# Altium project roach2_project.PrjPCB (part 6 of 13)

## Sheet qdr0_1.SchDoc: Virtex-6 QDRs 0 & 1
size A3; Date: DO NOT USE, RATHER USE PROJ OPTIONS; DrawnBy: DO NOT USE, RATHER USE PROJ OPTIONS; Engineer: DO NOT USE, RATHER USE PROJ OPTIONS; Organization: DO NOT USE, RATHER USE PROJ OPTIONS; DocumentNumber: DO NOT USE, RATHER USE PROJ OPTIONS; Revision: DO NOT USE, RATHER USE PROJ OPTIONS; SheetNumber: 19; SheetTotal: 27; SCH_Sheet_Filename: qdr0_1.SchDoc; CurrentTime: DO NOT USE, RATHER USE PROJ OPTIONS; Time: DO NOT USE, RATHER USE PROJ OPTIONS; DocumentFullPathAndName: DO NOT USE, RATHER USE PROJ OPTIONS; DocumentName: DO NOT USE, RATHER USE PROJ OPTIONS; ModifiedDate: DO NOT USE, RATHER USE PROJ OPTIONS; ImagePath: DO NOT USE, RATHER USE PROJ OPTIONS
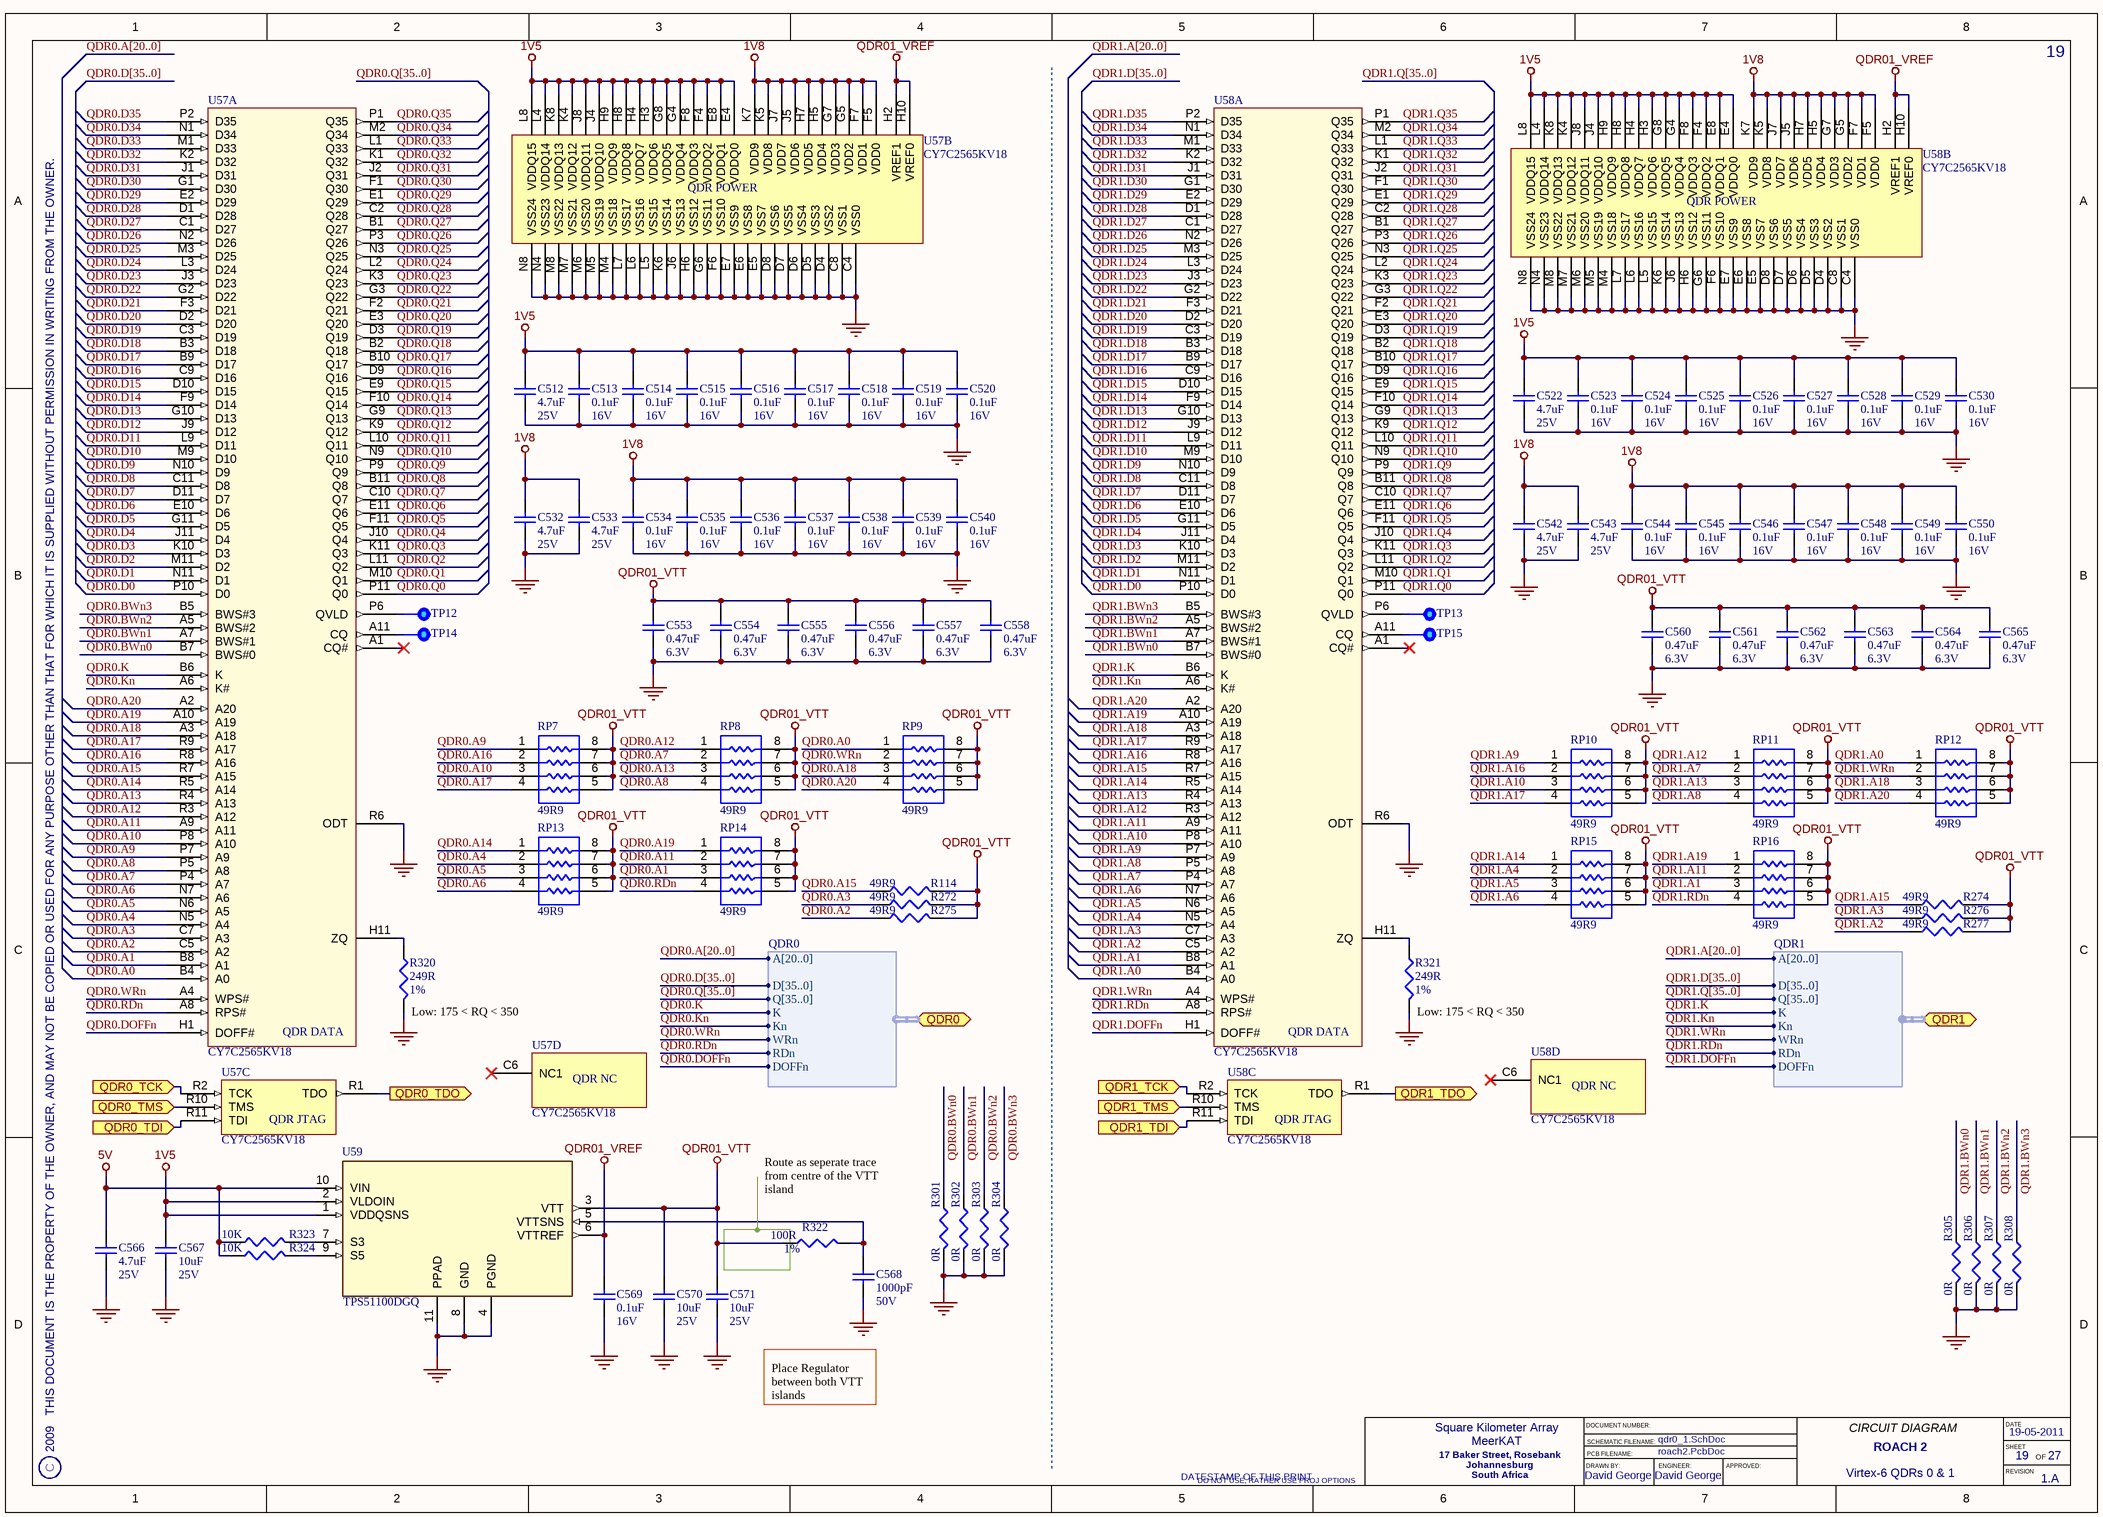
[diagram p11: qdr0_1.SchDoc]

### Parts
C512  Rating: 25V  [CAPC2012X127L]  (hidden comment: 4.7uF)
C513  Rating: 16V  [CAPC1005X60L]  (hidden comment: 0.1uF)
C514  Rating: 16V  [CAPC1005X60L]  (hidden comment: 0.1uF)
C515  Rating: 16V  [CAPC1005X60L]  (hidden comment: 0.1uF)
C516  Rating: 16V  [CAPC1005X60L]  (hidden comment: 0.1uF)
C517  Rating: 16V  [CAPC1005X60L]  (hidden comment: 0.1uF)
C518  Rating: 16V  [CAPC1005X60L]  (hidden comment: 0.1uF)
C519  Rating: 16V  [CAPC1005X60L]  (hidden comment: 0.1uF)
C520  Rating: 16V  [CAPC1005X60L]  (hidden comment: 0.1uF)
C522  Rating: 25V  [CAPC2012X127L]  (hidden comment: 4.7uF)
C523  Rating: 16V  [CAPC1005X60L]  (hidden comment: 0.1uF)
C524  Rating: 16V  [CAPC1005X60L]  (hidden comment: 0.1uF)
C525  Rating: 16V  [CAPC1005X60L]  (hidden comment: 0.1uF)
C526  Rating: 16V  [CAPC1005X60L]  (hidden comment: 0.1uF)
C527  Rating: 16V  [CAPC1005X60L]  (hidden comment: 0.1uF)
C528  Rating: 16V  [CAPC1005X60L]  (hidden comment: 0.1uF)
C529  Rating: 16V  [CAPC1005X60L]  (hidden comment: 0.1uF)
C530  Rating: 16V  [CAPC1005X60L]  (hidden comment: 0.1uF)
C532  Rating: 25V  [CAPC2012X127L]  (hidden comment: 4.7uF)
C533  Rating: 25V  [CAPC2012X127L]  (hidden comment: 4.7uF)
C534  Rating: 16V  [CAPC1005X60L]  (hidden comment: 0.1uF)
C535  Rating: 16V  [CAPC1005X60L]  (hidden comment: 0.1uF)
C536  Rating: 16V  [CAPC1005X60L]  (hidden comment: 0.1uF)
C537  Rating: 16V  [CAPC1005X60L]  (hidden comment: 0.1uF)
C538  Rating: 16V  [CAPC1005X60L]  (hidden comment: 0.1uF)
C539  Rating: 16V  [CAPC1005X60L]  (hidden comment: 0.1uF)
C540  Rating: 16V  [CAPC1005X60L]  (hidden comment: 0.1uF)
C542  Rating: 25V  [CAPC2012X127L]  (hidden comment: 4.7uF)
C543  Rating: 25V  [CAPC2012X127L]  (hidden comment: 4.7uF)
C544  Rating: 16V  [CAPC1005X60L]  (hidden comment: 0.1uF)
C545  Rating: 16V  [CAPC1005X60L]  (hidden comment: 0.1uF)
C546  Rating: 16V  [CAPC1005X60L]  (hidden comment: 0.1uF)
C547  Rating: 16V  [CAPC1005X60L]  (hidden comment: 0.1uF)
C548  Rating: 16V  [CAPC1005X60L]  (hidden comment: 0.1uF)
C549  Rating: 16V  [CAPC1005X60L]  (hidden comment: 0.1uF)
C550  Rating: 16V  [CAPC1005X60L]  (hidden comment: 0.1uF)
C553  Rating: 6.3V  [CAPC1005X55L]  (hidden comment: 0.47uF)
C554  Rating: 6.3V  [CAPC1005X55L]  (hidden comment: 0.47uF)
C555  Rating: 6.3V  [CAPC1005X55L]  (hidden comment: 0.47uF)
C556  Rating: 6.3V  [CAPC1005X55L]  (hidden comment: 0.47uF)
C557  Rating: 6.3V  [CAPC1005X55L]  (hidden comment: 0.47uF)
C558  Rating: 6.3V  [CAPC1005X55L]  (hidden comment: 0.47uF)
C560  Rating: 6.3V  [CAPC1005X55L]  (hidden comment: 0.47uF)
C561  Rating: 6.3V  [CAPC1005X55L]  (hidden comment: 0.47uF)
C562  Rating: 6.3V  [CAPC1005X55L]  (hidden comment: 0.47uF)
C563  Rating: 6.3V  [CAPC1005X55L]  (hidden comment: 0.47uF)
C564  Rating: 6.3V  [CAPC1005X55L]  (hidden comment: 0.47uF)
C565  Rating: 6.3V  [CAPC1005X55L]  (hidden comment: 0.47uF)
C566  Rating: 25V  [CAPC2012X127L]  (hidden comment: 4.7uF)
C567  Rating: 25V  [CAPC3225X200L]  (hidden comment: 10uF)
C568  Rating: 50V  [CAPC1005X55L]  (hidden comment: 1000pF)
C569  Rating: 16V  [CAPC1005X60L]  (hidden comment: 0.1uF)
C570  Rating: 25V  [CAPC3225X200L]  (hidden comment: 10uF)
C571  Rating: 25V  [CAPC3225X200L]  (hidden comment: 10uF)
R114  49R9  [RESC1005X40L]
R272  49R9  [RESC1005X40L]
R274  49R9  [RESC1005X40L]
R275  49R9  [RESC1005X40L]
R276  49R9  [RESC1005X40L]
R277  49R9  [RESC1005X40L]
R301  0R  [RESC1005X40L]
R302  0R  [RESC1005X40L]
R303  0R  [RESC1005X40L]
R304  0R  [RESC1005X40L]
R305  0R  [RESC1005X40L]
R306  0R  [RESC1005X40L]
R307  0R  [RESC1005X40L]
R308  0R  [RESC1005X40L]
R320  Tolerance: 1%  [RESC1005X40L]  (hidden comment: 249R)
R321  Tolerance: 1%  [RESC1005X40L]  (hidden comment: 249R)
R322  Tolerance: 1%  [RESC1005X40L]  (hidden comment: 100R)
R323  10K  [RESC1005X40L]
R324  10K  [RESC1005X40L]
RP7  49R9  [RESCAV50P100X200X45-8L]
RP8  49R9  [RESCAV50P100X200X45-8L]
RP9  49R9  [RESCAV50P100X200X45-8L]
RP10  49R9  [RESCAV50P100X200X45-8L]
RP11  49R9  [RESCAV50P100X200X45-8L]
RP12  49R9  [RESCAV50P100X200X45-8L]
RP13  49R9  [RESCAV50P100X200X45-8L]
RP14  49R9  [RESCAV50P100X200X45-8L]
RP15  49R9  [RESCAV50P100X200X45-8L]
RP16  49R9  [RESCAV50P100X200X45-8L]
TP12  Testpoint  [TP100]  (value not drawn)  (no BOM)
TP13  Testpoint  [TP100]  (value not drawn)  (no BOM)
TP14  Testpoint  [TP100]  (value not drawn)  (no BOM)
TP15  Testpoint  [TP100]  (value not drawn)  (no BOM)
U57  CY7C2565KV18  [FBGA_165-Ball]  (parts A,B,C,D of 4)
U58  CY7C2565KV18  [FBGA_165-Ball]  (parts A,B,C,D of 4)
U59  TPS51100DGQ  [MSOP_10-N]

### Ports
QDR0 (harness QDR0), QDR0_TCK (in), QDR0_TDI (in), QDR0_TDO (out), QDR0_TMS (in), QDR1 (harness QDR1), QDR1_TCK (in), QDR1_TDI (in), QDR1_TDO (out), QDR1_TMS (in)

### Harnesses
QDR0: A[20..0], D[35..0], Q[35..0], K, Kn, WRn, RDn, DOFFn
QDR1: A[20..0], D[35..0], Q[35..0], K, Kn, WRn, RDn, DOFFn

### Nets
1V5: C512.2 C513.2 C514.2 C515.2 C516.2 C517.2 C518.2 C519.2 C520.2 C522.2 C523.2 C524.2 C525.2 C526.2 C527.2 C528.2 C529.2 C530.2 C567.2 U57.E4(VDDQ0) U57.E8(VDDQ1) U57.F4(VDDQ2) U57.F8(VDDQ3) U57.G4(VDDQ4) U57.G8(VDDQ5) U57.H3(VDDQ6) U57.H4(VDDQ7) U57.H8(VDDQ8) U57.H9(VDDQ9) U57.J4(VDDQ10) U57.J8(VDDQ11) U57.K4(VDDQ12) U57.K8(VDDQ13) U57.L4(VDDQ14) U57.L8(VDDQ15) U58.E4(VDDQ0) U58.E8(VDDQ1) U58.F4(VDDQ2) U58.F8(VDDQ3) U58.G4(VDDQ4) U58.G8(VDDQ5) U58.H3(VDDQ6) U58.H4(VDDQ7) U58.H8(VDDQ8) U58.H9(VDDQ9) U58.J4(VDDQ10) U58.J8(VDDQ11) U58.K4(VDDQ12) U58.K8(VDDQ13) U58.L4(VDDQ14) U58.L8(VDDQ15) U59.1(VDDQSNS) U59.2(VLDOIN)
1V8: C532.2 C533.2 C534.2 C535.2 C536.2 C537.2 C538.2 C539.2 C540.2 C542.2 C543.2 C544.2 C545.2 C546.2 C547.2 C548.2 C549.2 C550.2 U57.F5(VDD0) U57.F7(VDD1) U57.G5(VDD2) U57.G7(VDD3) U57.H5(VDD4) U57.H7(VDD5) U57.J5(VDD6) U57.J7(VDD7) U57.K5(VDD8) U57.K7(VDD9) U58.F5(VDD0) U58.F7(VDD1) U58.G5(VDD2) U58.G7(VDD3) U58.H5(VDD4) U58.H7(VDD5) U58.J5(VDD6) U58.J7(VDD7) U58.K5(VDD8) U58.K7(VDD9)
5V: C566.2 R323.1 R324.1 U59.10(VIN)
GND: C512.1 C513.1 C514.1 C515.1 C516.1 C517.1 C518.1 C519.1 C520.1 C522.1 C523.1 C524.1 C525.1 C526.1 C527.1 C528.1 C529.1 C530.1 C532.1 C533.1 C534.1 C535.1 C536.1 C537.1 C538.1 C539.1 C540.1 C542.1 C543.1 C544.1 C545.1 C546.1 C547.1 C548.1 C549.1 C550.1 C553.1 C554.1 C555.1 C556.1 C557.1 C558.1 C560.1 C561.1 C562.1 C563.1 C564.1 C565.1 C566.1 C567.1 C568.1 C569.1 C570.1 C571.1 R301.2 R302.2 R303.2 R304.2 R305.2 R306.2 R307.2 R308.2 R320.2 R321.2 U57.C4(VSS0) U57.C8(VSS1) U57.D4(VSS2) U57.D5(VSS3) U57.D6(VSS4) U57.D7(VSS5) U57.D8(VSS6) U57.E5(VSS7) U57.E6(VSS8) U57.E7(VSS9) U57.F6(VSS10) U57.G6(VSS11) U57.H6(VSS12) U57.J6(VSS13) U57.K6(VSS14) U57.L5(VSS15) U57.L6(VSS16) U57.L7(VSS17) U57.M4(VSS18) U57.M5(VSS19) U57.M6(VSS20) U57.M7(VSS21) U57.M8(VSS22) U57.N4(VSS23) U57.N8(VSS24) U57.R6(ODT) U58.C4(VSS0) U58.C8(VSS1) U58.D4(VSS2) U58.D5(VSS3) U58.D6(VSS4) U58.D7(VSS5) U58.D8(VSS6) U58.E5(VSS7) U58.E6(VSS8) U58.E7(VSS9) U58.F6(VSS10) U58.G6(VSS11) U58.H6(VSS12) U58.J6(VSS13) U58.K6(VSS14) U58.L5(VSS15) U58.L6(VSS16) U58.L7(VSS17) U58.M4(VSS18) U58.M5(VSS19) U58.M6(VSS20) U58.M7(VSS21) U58.M8(VSS22) U58.N4(VSS23) U58.N8(VSS24) U58.R6(ODT) U59.4(PGND) U59.8(GND) U59.11(PPAD)
QDR01_VREF: C569.2 U57.H2(VREF1) U57.H10(VREF0) U58.H2(VREF1) U58.H10(VREF0) U59.6(VTTREF)
QDR01_VTT: C553.2 C554.2 C555.2 C556.2 C557.2 C558.2 C560.2 C561.2 C562.2 C563.2 C564.2 C565.2 C570.2 C571.2 R114.2 R272.2 R274.2 R275.2 R276.2 R277.2 R322.1 RP7.5 RP7.6 RP7.7 RP7.8 RP8.5 RP8.6 RP8.7 RP8.8 RP9.5 RP9.6 RP9.7 RP9.8 RP10.5 RP10.6 RP10.7 RP10.8 RP11.5 RP11.6 RP11.7 RP11.8 RP12.5 RP12.6 RP12.7 RP12.8 RP13.5 RP13.6 RP13.7 RP13.8 RP14.5 RP14.6 RP14.7 RP14.8 RP15.5 RP15.6 RP15.7 RP15.8 RP16.5 RP16.6 RP16.7 RP16.8 U59.3(VTT)
QDR0.A0: RP9.1 U57.B4(A0)
QDR0.A1: RP14.3 U57.B8(A1)
QDR0.A2: R275.1 U57.C5(A2)
QDR0.A3: R272.1 U57.C7(A3)
QDR0.A4: RP13.2 U57.N5(A4)
QDR0.A5: RP13.3 U57.N6(A5)
QDR0.A6: RP13.4 U57.N7(A6)
QDR0.A7: RP8.2 U57.P4(A7)
QDR0.A8: RP8.4 U57.P5(A8)
QDR0.A9: RP7.1 U57.P7(A9)
QDR0.A10: RP7.3 U57.P8(A10)
QDR0.A11: RP14.2 U57.A9(A11)
QDR0.A12: RP8.1 U57.R3(A12)
QDR0.A13: RP8.3 U57.R4(A13)
QDR0.A14: RP13.1 U57.R5(A14)
QDR0.A15: R114.1 U57.R7(A15)
QDR0.A16: RP7.2 U57.R8(A16)
QDR0.A17: RP7.4 U57.R9(A17)
QDR0.A18: RP9.3 U57.A3(A18)
QDR0.A19: RP14.1 U57.A10(A19)
QDR0.A20: RP9.4 U57.A2(A20)
QDR0.BWn0: R301.1 U57.B7(BWS#0)
QDR0.BWn1: R302.1 U57.A7(BWS#1)
QDR0.BWn2: R303.1 U57.A5(BWS#2)
QDR0.BWn3: R304.1 U57.B5(BWS#3)
QDR0.D0: U57.P10(D0)
QDR0.D1: U57.N11(D1)
QDR0.D2: U57.M11(D2)
QDR0.D3: U57.K10(D3)
QDR0.D4: U57.J11(D4)
QDR0.D5: U57.G11(D5)
QDR0.D6: U57.E10(D6)
QDR0.D7: U57.D11(D7)
QDR0.D8: U57.C11(D8)
QDR0.D9: U57.N10(D9)
QDR0.D10: U57.M9(D10)
QDR0.D11: U57.L9(D11)
QDR0.D12: U57.J9(D12)
QDR0.D13: U57.G10(D13)
QDR0.D14: U57.F9(D14)
QDR0.D15: U57.D10(D15)
QDR0.D16: U57.C9(D16)
QDR0.D17: U57.B9(D17)
QDR0.D18: U57.B3(D18)
QDR0.D19: U57.C3(D19)
QDR0.D20: U57.D2(D20)
QDR0.D21: U57.F3(D21)
QDR0.D22: U57.G2(D22)
QDR0.D23: U57.J3(D23)
QDR0.D24: U57.L3(D24)
QDR0.D25: U57.M3(D25)
QDR0.D26: U57.N2(D26)
QDR0.D27: U57.C1(D27)
QDR0.D28: U57.D1(D28)
QDR0.D29: U57.E2(D29)
QDR0.D30: U57.G1(D30)
QDR0.D31: U57.J1(D31)
QDR0.D32: U57.K2(D32)
QDR0.D33: U57.M1(D33)
QDR0.D34: U57.N1(D34)
QDR0.D35: U57.P2(D35)
QDR0.DOFFn: U57.H1(DOFF#) ; port QDR0.DOFFn
QDR0.K: U57.B6(K) ; port QDR0.K
QDR0.Kn: U57.A6(K#) ; port QDR0.Kn
QDR0.Q0: U57.P11(Q0)
QDR0.Q1: U57.M10(Q1)
QDR0.Q2: U57.L11(Q2)
QDR0.Q3: U57.K11(Q3)
QDR0.Q4: U57.J10(Q4)
QDR0.Q5: U57.F11(Q5)
QDR0.Q6: U57.E11(Q6)
QDR0.Q7: U57.C10(Q7)
QDR0.Q8: U57.B11(Q8)
QDR0.Q9: U57.P9(Q9)
QDR0.Q10: U57.N9(Q10)
QDR0.Q11: U57.L10(Q11)
QDR0.Q12: U57.K9(Q12)
QDR0.Q13: U57.G9(Q13)
QDR0.Q14: U57.F10(Q14)
QDR0.Q15: U57.E9(Q15)
QDR0.Q16: U57.D9(Q16)
QDR0.Q17: U57.B10(Q17)
QDR0.Q18: U57.B2(Q18)
QDR0.Q19: U57.D3(Q19)
QDR0.Q20: U57.E3(Q20)
QDR0.Q21: U57.F2(Q21)
QDR0.Q22: U57.G3(Q22)
QDR0.Q23: U57.K3(Q23)
QDR0.Q24: U57.L2(Q24)
QDR0.Q25: U57.N3(Q25)
QDR0.Q26: U57.P3(Q26)
QDR0.Q27: U57.B1(Q27)
QDR0.Q28: U57.C2(Q28)
QDR0.Q29: U57.E1(Q29)
QDR0.Q30: U57.F1(Q30)
QDR0.Q31: U57.J2(Q31)
QDR0.Q32: U57.K1(Q32)
QDR0.Q33: U57.L1(Q33)
QDR0.Q34: U57.M2(Q34)
QDR0.Q35: U57.P1(Q35)
QDR0.RDn: RP14.4 U57.A8(RPS#) ; port QDR0.RDn
QDR0.WRn: RP9.2 U57.A4(WPS#) ; port QDR0.WRn
QDR0_TCK: U57.R2(TCK) ; port QDR0_TCK
QDR0_TDI: U57.R11(TDI) ; port QDR0_TDI
QDR0_TDO: U57.R1(TDO) ; port QDR0_TDO
QDR0_TMS: U57.R10(TMS) ; port QDR0_TMS
QDR1.A0: RP12.1 U58.B4(A0)
QDR1.A1: RP16.3 U58.B8(A1)
QDR1.A2: R277.1 U58.C5(A2)
QDR1.A3: R276.1 U58.C7(A3)
QDR1.A4: RP15.2 U58.N5(A4)
QDR1.A5: RP15.3 U58.N6(A5)
QDR1.A6: RP15.4 U58.N7(A6)
QDR1.A7: RP11.2 U58.P4(A7)
QDR1.A8: RP11.4 U58.P5(A8)
QDR1.A9: RP10.1 U58.P7(A9)
QDR1.A10: RP10.3 U58.P8(A10)
QDR1.A11: RP16.2 U58.A9(A11)
QDR1.A12: RP11.1 U58.R3(A12)
QDR1.A13: RP11.3 U58.R4(A13)
QDR1.A14: RP15.1 U58.R5(A14)
QDR1.A15: R274.1 U58.R7(A15)
QDR1.A16: RP10.2 U58.R8(A16)
QDR1.A17: RP10.4 U58.R9(A17)
QDR1.A18: RP12.3 U58.A3(A18)
QDR1.A19: RP16.1 U58.A10(A19)
QDR1.A20: RP12.4 U58.A2(A20)
QDR1.BWn0: R305.1 U58.B7(BWS#0)
QDR1.BWn1: R306.1 U58.A7(BWS#1)
QDR1.BWn2: R307.1 U58.A5(BWS#2)
QDR1.BWn3: R308.1 U58.B5(BWS#3)
QDR1.D0: U58.P10(D0)
QDR1.D1: U58.N11(D1)
QDR1.D2: U58.M11(D2)
QDR1.D3: U58.K10(D3)
QDR1.D4: U58.J11(D4)
QDR1.D5: U58.G11(D5)
QDR1.D6: U58.E10(D6)
QDR1.D7: U58.D11(D7)
QDR1.D8: U58.C11(D8)
QDR1.D9: U58.N10(D9)
QDR1.D10: U58.M9(D10)
QDR1.D11: U58.L9(D11)
QDR1.D12: U58.J9(D12)
QDR1.D13: U58.G10(D13)
QDR1.D14: U58.F9(D14)
QDR1.D15: U58.D10(D15)
QDR1.D16: U58.C9(D16)
QDR1.D17: U58.B9(D17)
QDR1.D18: U58.B3(D18)
QDR1.D19: U58.C3(D19)
QDR1.D20: U58.D2(D20)
QDR1.D21: U58.F3(D21)
QDR1.D22: U58.G2(D22)
QDR1.D23: U58.J3(D23)
QDR1.D24: U58.L3(D24)
QDR1.D25: U58.M3(D25)
QDR1.D26: U58.N2(D26)
QDR1.D27: U58.C1(D27)
QDR1.D28: U58.D1(D28)
QDR1.D29: U58.E2(D29)
QDR1.D30: U58.G1(D30)
QDR1.D31: U58.J1(D31)
QDR1.D32: U58.K2(D32)
QDR1.D33: U58.M1(D33)
QDR1.D34: U58.N1(D34)
QDR1.D35: U58.P2(D35)
QDR1.DOFFn: U58.H1(DOFF#) ; port QDR1.DOFFn
QDR1.K: U58.B6(K) ; port QDR1.K
QDR1.Kn: U58.A6(K#) ; port QDR1.Kn
QDR1.Q0: U58.P11(Q0)
QDR1.Q1: U58.M10(Q1)
QDR1.Q2: U58.L11(Q2)
QDR1.Q3: U58.K11(Q3)
QDR1.Q4: U58.J10(Q4)
QDR1.Q5: U58.F11(Q5)
QDR1.Q6: U58.E11(Q6)
QDR1.Q7: U58.C10(Q7)
QDR1.Q8: U58.B11(Q8)
QDR1.Q9: U58.P9(Q9)
QDR1.Q10: U58.N9(Q10)
QDR1.Q11: U58.L10(Q11)
QDR1.Q12: U58.K9(Q12)
QDR1.Q13: U58.G9(Q13)
QDR1.Q14: U58.F10(Q14)
QDR1.Q15: U58.E9(Q15)
QDR1.Q16: U58.D9(Q16)
QDR1.Q17: U58.B10(Q17)
QDR1.Q18: U58.B2(Q18)
QDR1.Q19: U58.D3(Q19)
QDR1.Q20: U58.E3(Q20)
QDR1.Q21: U58.F2(Q21)
QDR1.Q22: U58.G3(Q22)
QDR1.Q23: U58.K3(Q23)
QDR1.Q24: U58.L2(Q24)
QDR1.Q25: U58.N3(Q25)
QDR1.Q26: U58.P3(Q26)
QDR1.Q27: U58.B1(Q27)
QDR1.Q28: U58.C2(Q28)
QDR1.Q29: U58.E1(Q29)
QDR1.Q30: U58.F1(Q30)
QDR1.Q31: U58.J2(Q31)
QDR1.Q32: U58.K1(Q32)
QDR1.Q33: U58.L1(Q33)
QDR1.Q34: U58.M2(Q34)
QDR1.Q35: U58.P1(Q35)
QDR1.RDn: RP16.4 U58.A8(RPS#) ; port QDR1.RDn
QDR1.WRn: RP12.2 U58.A4(WPS#) ; port QDR1.WRn
QDR1_TCK: U58.R2(TCK) ; port QDR1_TCK
QDR1_TDI: U58.R11(TDI) ; port QDR1_TDI
QDR1_TDO: U58.R1(TDO) ; port QDR1_TDO
QDR1_TMS: U58.R10(TMS) ; port QDR1_TMS
NetC568_2: C568.2 R322.2 U59.5(VTTSNS)
NetR320_1: R320.1 U57.H11(ZQ)
NetR321_1: R321.1 U58.H11(ZQ)
NetR323_2: R323.2 U59.7(S3)
NetR324_2: R324.2 U59.9(S5)
NetTP12_1: TP12.1 U57.P6(QVLD)
NetTP13_1: TP13.1 U58.P6(QVLD)
NetTP14_1: TP14.1 U57.A11(CQ)
NetTP15_1: TP15.1 U58.A11(CQ)

Not connected (* = marked no-connect by the designer): U57 A1(CQ#)* C6(NC1)*; U58 A1(CQ#)* C6(NC1)*

### Buses and harness runs
bus QDR0.A[20..0]
bus QDR0.D[35..0]
bus QDR0.Q[35..0]
bus QDR1.A[20..0]
bus QDR1.D[35..0]
bus QDR1.Q[35..0]

### Notes on the sheet
- (near R320) Low: 175 < RQ < 350
- (near R321) Low: 175 < RQ < 350
- Route as seperate trace from centre of the VTT island
- Place Regulator between both VTT islands
- 2009   THIS DOCUMENT IS THE PROPERTY OF THE OWNER, AND MAY NOT BE COPIED OR USED FOR ANY PURPOSE OTHER THAN THAT FOR WHICH IT IS SUPPLIED WITHOUT PERMISSION IN WRITING FROM THE OWNER.
- C
- DATESTAMP OF THIS PRINT
- DRAWN BY:
- DOCUMENT NUMBER:
- SCHEMATIC FILENAME:
- PCB FILENAME:
- ENGINEER:
- APPROVED:
- CIRCUIT DIAGRAM
- DATE
- SHEET
- REVISION
- OF
- (in symbol IC-MEM-1, part A) QDR DATA
- (in symbol IC-MEM-1, part B) QDR POWER
- (in symbol IC-MEM-1, part C) QDR JTAG
- (in symbol IC-MEM-1, part D) QDR NC

### Library data of the parts
C512 C522 C532 C533 C542 C543 C566 = CAP-CER-3: 4.7uF, Ceramic Capacitor; Manufacturer: MURATA; PartNum: GRM21BR61E475KA12K; Tolerance: 10%; Dielectric: X5R; POD number: CAP-CER-3; Value: 4.7uF; RoHS: Y; Sort Value: 4.7; Category: Capacitors; Subcategory: Ceramic
C513-C520 C523-C530 C534-C540 C544-C550 C569 = CAP-CER-1: 0.1uF, Ceramic Capacitor; Manufacturer: VENKEL; PartNum: C0402X7R160-104KN; Tolerance: 10%; Dielectric: X7R; POD number: CAP-CER-1; Value: 0.1uF; RoHS: Y; Sort Value: 0.1; Category: Capacitors; Subcategory: Ceramic
C553-C558 C560-C565 = CAP-CER-7: 0.47uF, Ceramic Capacitor; Manufacturer: MURATA; PartNum: GRM155R60J474KE19; Tolerance: 10%; Dielectric: X5R; POD number: CAP-CER-7; Value: 0.47uF; RoHS: Y; Sort Value: 0.47; Category: Capacitors; Subcategory: Ceramic
C567 C570 C571 = CAP-CER-5: 10uF, Ceramic Capacitor; Manufacturer: MURATA; PartNum: GRM32DR61E106KA12L; Tolerance: 10%; Dielectric: X5R; POD number: CAP-CER-5; Value: 10uF; RoHS: Y; Sort Value: 100; Category: Capacitors; Subcategory: Ceramic
C568 = CAP-CER-4: 1000pF, Ceramic Capacitor; Manufacturer: MURATA; PartNum: GRM155R61H102KA01D; Tolerance: 10%; Dielectric: X5R; POD number: CAP-CER-4; Value: 1000pF; RoHS: Y; Sort Value: 0.0001; Category: Capacitors; Subcategory: Ceramic
R114 R272 R274-R277 = RES-TF-10: 49R9, 1.1mm x 0.5mm, Thick Film Resistor; Manufacturer: ROYALOHM; PartNum: 0402WGF499JT1E; Tolerance: 1%; Rating: 0.0625W; POD number: RES-TF-10; Value: 49R9; Sort Value: 49.9; Category: Resistors; Subcategory: ThickFilm; HelpURL: *.pdf
R301-R308 = RES-TF-0: 0R, 1.1mm x 0.5mm, Thick Film Resistor; Manufacturer: ROYALOHM; PartNum: 0402WG00000T1E; Tolerance: 0%; Rating: 0.0625W; POD number: RES-TF-0; Value: 0R; Sort Value: 0; Category: Resistors; Subcategory: ThickFilm; HelpURL: *.pdf
R320 R321 = RES-TF-15: 249R, 1.1mm x 0.5mm, Thick Film Resistor; Manufacturer: ROYALOHM; PartNum: 0402WGF2490T1E; Rating: 0.0625W; POD number: RES-TF-15; Value: 249R; Sort Value: 249; Category: Resistors; Subcategory: ThickFilm; HelpURL: *.pdf
R322 = RES-TF-14: 100R, 1.1mm x 0.5mm, Thick Film Resistor; Manufacturer: ROYALOHM; PartNum: 0402WGF0101T1E; Rating: 0.0625W; POD number: RES-TF-14; Value: 100R; Sort Value: 1000; Category: Resistors; Subcategory: ThickFilm; HelpURL: *.pdf
R323 R324 = RES-TF-5: 10K, 1.1mm x 0.5mm, Thick Film Resistor; Manufacturer: ROYALOHM; PartNum: 0402WGJ0103T1E; Tolerance: 5%; Rating: 0.0625W; POD number: RES-TF-5; Value: 10K; Sort Value: 10000; Category: Resistors; Subcategory: ThickFilm; HelpURL: *.pdf
RP7-RP16 = RES-TF-39: 4-Wide, Isolated, Thick Film Resistor Network; Manufacturer: ROYALOHM; PartNum: 4D02WGJ0510B1E; Tolerance: 1%; Rating: 0.0625W; POD number: RES-TF-39; Value: 49R9; Sort Value: 49.9; Category: Resistors; Subcategory: ThickFilm
TP12-TP15 = ELMECH-TP-0: 1mm Diameter, through-hole, Circular Test-point; POD number: ELMECH-TP-0; RoHS: Y; Category: ELMECH; Subcategory: Test Points
U57 U58 = IC-MEM-1: 72Mb, 36-Bit wide, QDR2+ Synchronous SRAM with ODT; Manufacturer: Cypress; PartNum: CY7C2565KV18-450BZXC; POD number: IC-MEM-1; RoHS: Y; Category: IC; Subcategory: Memory
U59 = IC-REG-6: 3A Sink/Source Regulator; Manufacturer: Texas Instruments; POD number: IC-REG-6; PartNum: TPS51100DGQ; RoHS: Y; Category: IC; Subcategory: Regulators

## Sheet qdr2_3.SchDoc: Virtex-6 QDRs 2 & 3
size A3; Date: DO NOT USE, RATHER USE PROJ OPTIONS; DrawnBy: DO NOT USE, RATHER USE PROJ OPTIONS; Engineer: DO NOT USE, RATHER USE PROJ OPTIONS; Organization: DO NOT USE, RATHER USE PROJ OPTIONS; DocumentNumber: DO NOT USE, RATHER USE PROJ OPTIONS; Revision: DO NOT USE, RATHER USE PROJ OPTIONS; SheetNumber: 20; SheetTotal: 27; SCH_Sheet_Filename: qdr2_3.SchDoc; CurrentTime: DO NOT USE, RATHER USE PROJ OPTIONS; Time: DO NOT USE, RATHER USE PROJ OPTIONS; DocumentFullPathAndName: DO NOT USE, RATHER USE PROJ OPTIONS; DocumentName: DO NOT USE, RATHER USE PROJ OPTIONS; ModifiedDate: DO NOT USE, RATHER USE PROJ OPTIONS; ImagePath: DO NOT USE, RATHER USE PROJ OPTIONS
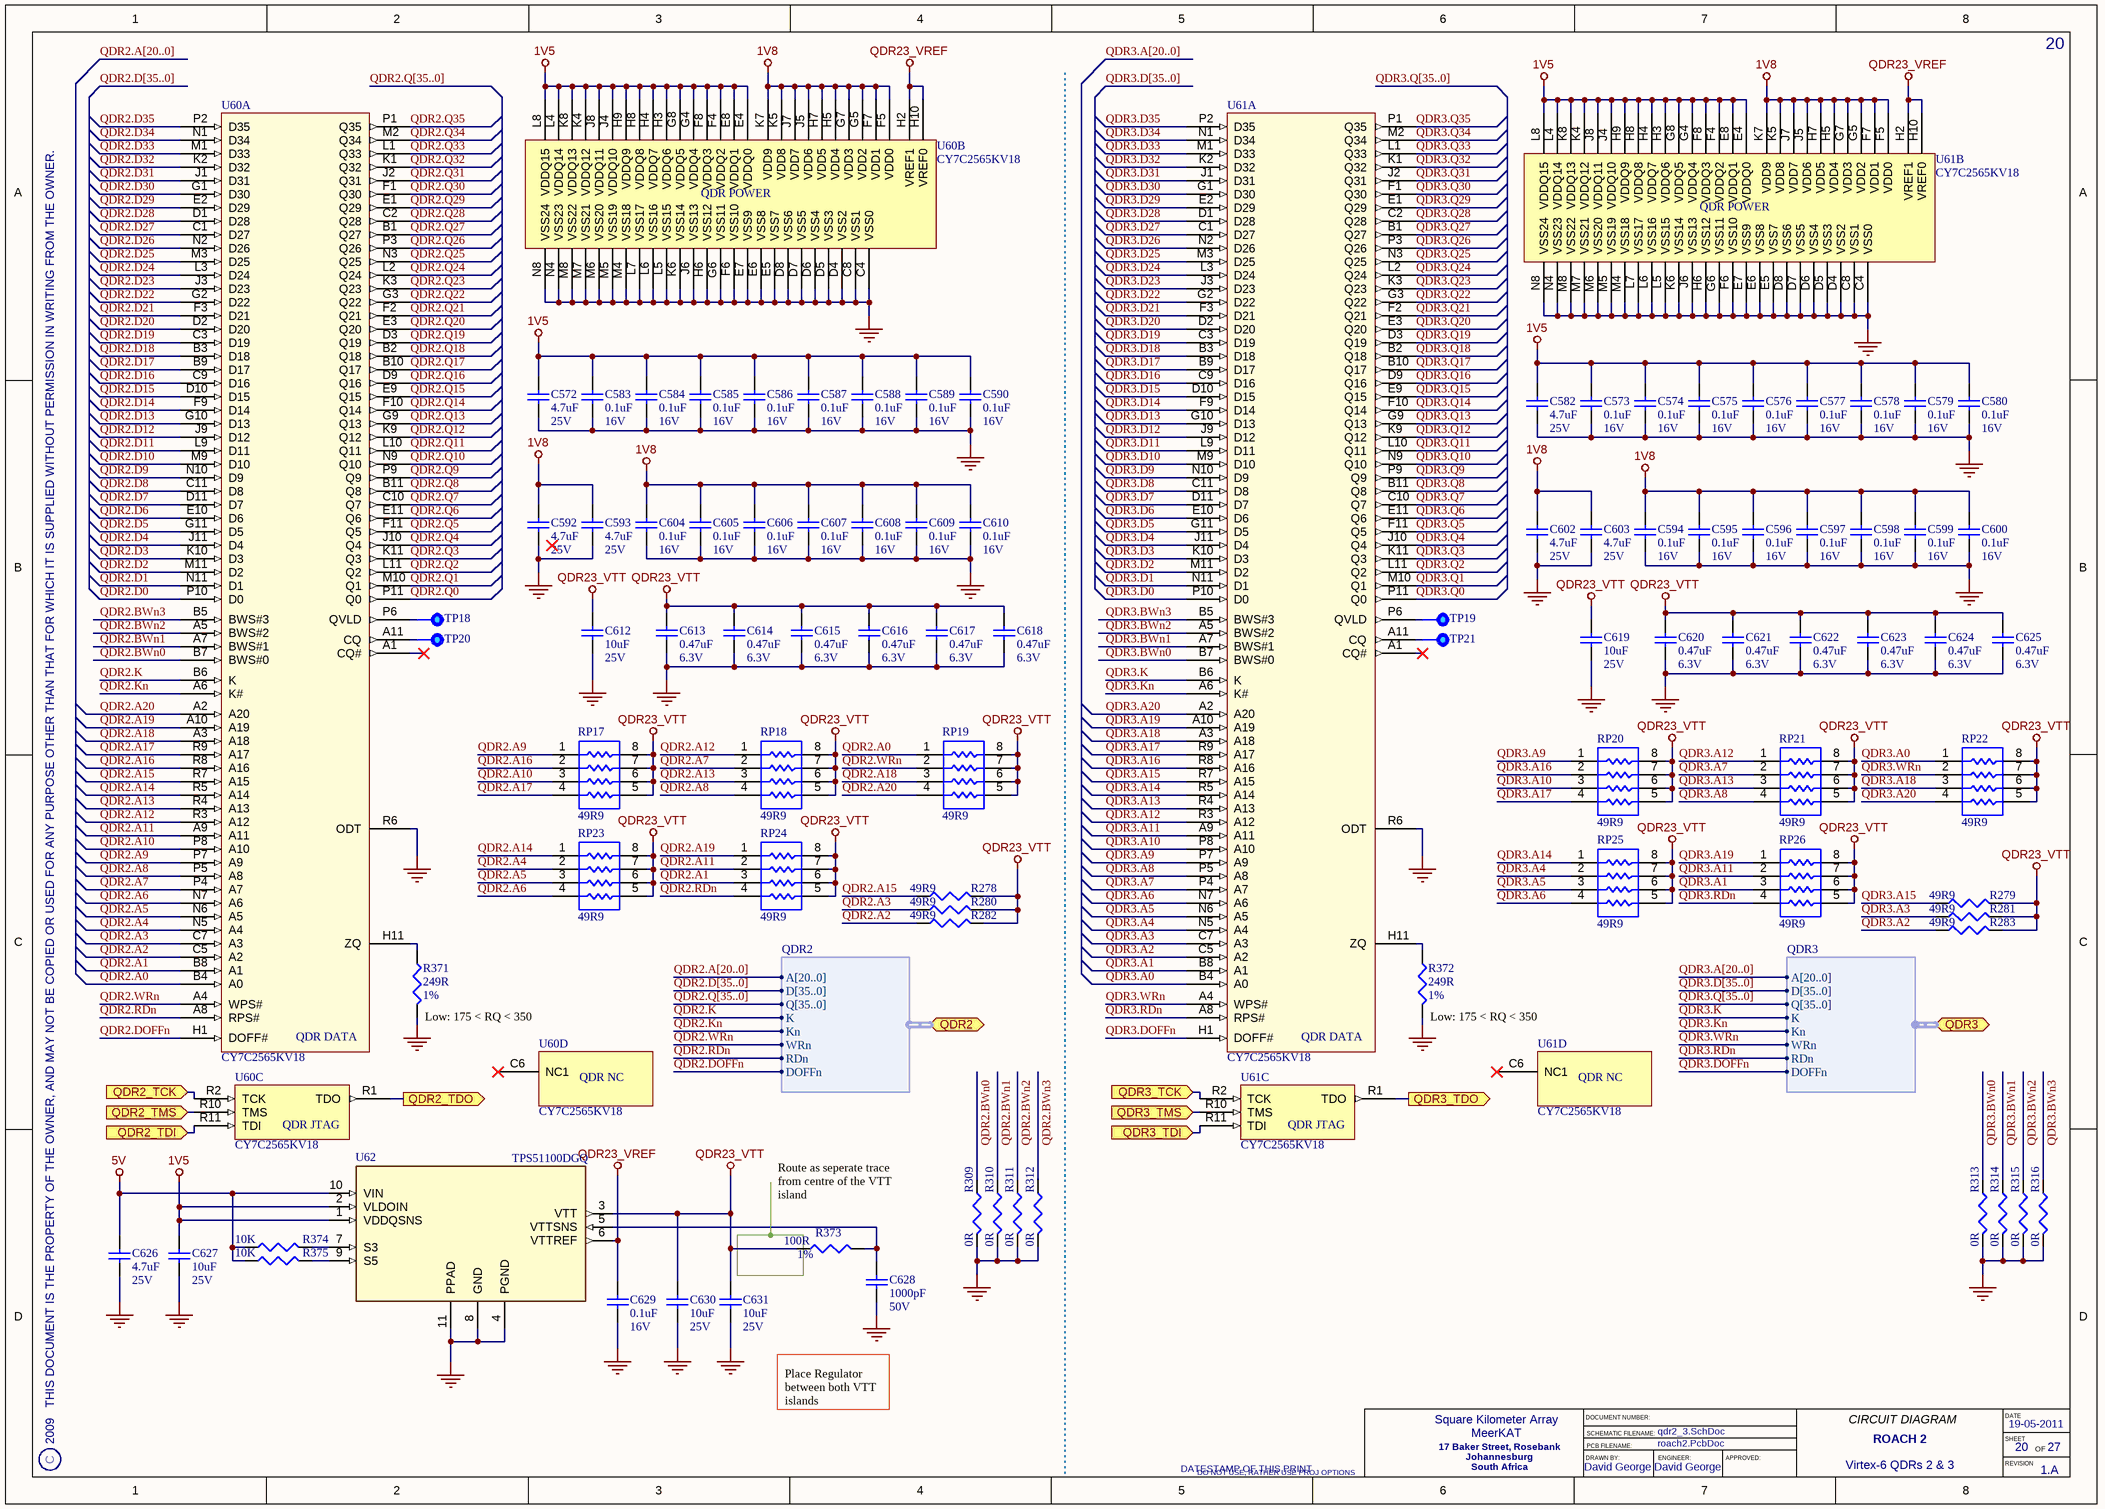
[diagram p12: qdr2_3.SchDoc]

### Parts
C572  Rating: 25V  [CAPC2012X127L]  (hidden comment: 4.7uF)
C573  Rating: 16V  [CAPC1005X60L]  (hidden comment: 0.1uF)
C574  Rating: 16V  [CAPC1005X60L]  (hidden comment: 0.1uF)
C575  Rating: 16V  [CAPC1005X60L]  (hidden comment: 0.1uF)
C576  Rating: 16V  [CAPC1005X60L]  (hidden comment: 0.1uF)
C577  Rating: 16V  [CAPC1005X60L]  (hidden comment: 0.1uF)
C578  Rating: 16V  [CAPC1005X60L]  (hidden comment: 0.1uF)
C579  Rating: 16V  [CAPC1005X60L]  (hidden comment: 0.1uF)
C580  Rating: 16V  [CAPC1005X60L]  (hidden comment: 0.1uF)
C582  Rating: 25V  [CAPC2012X127L]  (hidden comment: 4.7uF)
C583  Rating: 16V  [CAPC1005X60L]  (hidden comment: 0.1uF)
C584  Rating: 16V  [CAPC1005X60L]  (hidden comment: 0.1uF)
C585  Rating: 16V  [CAPC1005X60L]  (hidden comment: 0.1uF)
C586  Rating: 16V  [CAPC1005X60L]  (hidden comment: 0.1uF)
C587  Rating: 16V  [CAPC1005X60L]  (hidden comment: 0.1uF)
C588  Rating: 16V  [CAPC1005X60L]  (hidden comment: 0.1uF)
C589  Rating: 16V  [CAPC1005X60L]  (hidden comment: 0.1uF)
C590  Rating: 16V  [CAPC1005X60L]  (hidden comment: 0.1uF)
C592  Rating: 25V  [CAPC2012X127L]  (hidden comment: 4.7uF)
C593  Rating: 25V  [CAPC2012X127L]  (hidden comment: 4.7uF)
C594  Rating: 16V  [CAPC1005X60L]  (hidden comment: 0.1uF)
C595  Rating: 16V  [CAPC1005X60L]  (hidden comment: 0.1uF)
C596  Rating: 16V  [CAPC1005X60L]  (hidden comment: 0.1uF)
C597  Rating: 16V  [CAPC1005X60L]  (hidden comment: 0.1uF)
C598  Rating: 16V  [CAPC1005X60L]  (hidden comment: 0.1uF)
C599  Rating: 16V  [CAPC1005X60L]  (hidden comment: 0.1uF)
C600  Rating: 16V  [CAPC1005X60L]  (hidden comment: 0.1uF)
C602  Rating: 25V  [CAPC2012X127L]  (hidden comment: 4.7uF)
C603  Rating: 25V  [CAPC2012X127L]  (hidden comment: 4.7uF)
C604  Rating: 16V  [CAPC1005X60L]  (hidden comment: 0.1uF)
C605  Rating: 16V  [CAPC1005X60L]  (hidden comment: 0.1uF)
C606  Rating: 16V  [CAPC1005X60L]  (hidden comment: 0.1uF)
C607  Rating: 16V  [CAPC1005X60L]  (hidden comment: 0.1uF)
C608  Rating: 16V  [CAPC1005X60L]  (hidden comment: 0.1uF)
C609  Rating: 16V  [CAPC1005X60L]  (hidden comment: 0.1uF)
C610  Rating: 16V  [CAPC1005X60L]  (hidden comment: 0.1uF)
C612  Rating: 25V  [CAPC3225X200L]  (hidden comment: 10uF)
C613  Rating: 6.3V  [CAPC1005X55L]  (hidden comment: 0.47uF)
C614  Rating: 6.3V  [CAPC1005X55L]  (hidden comment: 0.47uF)
C615  Rating: 6.3V  [CAPC1005X55L]  (hidden comment: 0.47uF)
C616  Rating: 6.3V  [CAPC1005X55L]  (hidden comment: 0.47uF)
C617  Rating: 6.3V  [CAPC1005X55L]  (hidden comment: 0.47uF)
C618  Rating: 6.3V  [CAPC1005X55L]  (hidden comment: 0.47uF)
C619  Rating: 25V  [CAPC3225X200L]  (hidden comment: 10uF)
C620  Rating: 6.3V  [CAPC1005X55L]  (hidden comment: 0.47uF)
C621  Rating: 6.3V  [CAPC1005X55L]  (hidden comment: 0.47uF)
C622  Rating: 6.3V  [CAPC1005X55L]  (hidden comment: 0.47uF)
C623  Rating: 6.3V  [CAPC1005X55L]  (hidden comment: 0.47uF)
C624  Rating: 6.3V  [CAPC1005X55L]  (hidden comment: 0.47uF)
C625  Rating: 6.3V  [CAPC1005X55L]  (hidden comment: 0.47uF)
C626  Rating: 25V  [CAPC2012X127L]  (hidden comment: 4.7uF)
C627  Rating: 25V  [CAPC3225X200L]  (hidden comment: 10uF)
C628  Rating: 50V  [CAPC1005X55L]  (hidden comment: 1000pF)
C629  Rating: 16V  [CAPC1005X60L]  (hidden comment: 0.1uF)
C630  Rating: 25V  [CAPC3225X200L]  (hidden comment: 10uF)
C631  Rating: 25V  [CAPC3225X200L]  (hidden comment: 10uF)
R278  49R9  [RESC1005X40L]
R279  49R9  [RESC1005X40L]
R280  49R9  [RESC1005X40L]
R281  49R9  [RESC1005X40L]
R282  49R9  [RESC1005X40L]
R283  49R9  [RESC1005X40L]
R309  0R  [RESC1005X40L]
R310  0R  [RESC1005X40L]
R311  0R  [RESC1005X40L]
R312  0R  [RESC1005X40L]
R313  0R  [RESC1005X40L]
R314  0R  [RESC1005X40L]
R315  0R  [RESC1005X40L]
R316  0R  [RESC1005X40L]
R371  Tolerance: 1%  [RESC1005X40L]  (hidden comment: 249R)
R372  Tolerance: 1%  [RESC1005X40L]  (hidden comment: 249R)
R373  Tolerance: 1%  [RESC1005X40L]  (hidden comment: 100R)
R374  10K  [RESC1005X40L]
R375  10K  [RESC1005X40L]
RP17  49R9  [RESCAV50P100X200X45-8L]
RP18  49R9  [RESCAV50P100X200X45-8L]
RP19  49R9  [RESCAV50P100X200X45-8L]
RP20  49R9  [RESCAV50P100X200X45-8L]
RP21  49R9  [RESCAV50P100X200X45-8L]
RP22  49R9  [RESCAV50P100X200X45-8L]
RP23  49R9  [RESCAV50P100X200X45-8L]
RP24  49R9  [RESCAV50P100X200X45-8L]
RP25  49R9  [RESCAV50P100X200X45-8L]
RP26  49R9  [RESCAV50P100X200X45-8L]
TP18  Testpoint  [TP100]  (value not drawn)  (no BOM)
TP19  Testpoint  [TP100]  (value not drawn)  (no BOM)
TP20  Testpoint  [TP100]  (value not drawn)  (no BOM)
TP21  Testpoint  [TP100]  (value not drawn)  (no BOM)
U60  CY7C2565KV18  [FBGA_165-Ball]  (parts A,B,C,D of 4)
U61  CY7C2565KV18  [FBGA_165-Ball]  (parts A,B,C,D of 4)
U62  TPS51100DGQ  [MSOP_10-N]

### Ports
QDR2 (harness QDR2), QDR2_TCK (in), QDR2_TDI (in), QDR2_TDO (out), QDR2_TMS (in), QDR3 (harness QDR3), QDR3_TCK (in), QDR3_TDI (in), QDR3_TDO (out), QDR3_TMS (in)

### Harnesses
QDR2: A[20..0], D[35..0], Q[35..0], K, Kn, WRn, RDn, DOFFn
QDR3: A[20..0], D[35..0], Q[35..0], K, Kn, WRn, RDn, DOFFn

### Nets
1V5: C572.2 C573.2 C574.2 C575.2 C576.2 C577.2 C578.2 C579.2 C580.2 C582.2 C583.2 C584.2 C585.2 C586.2 C587.2 C588.2 C589.2 C590.2 C627.2 U60.E4(VDDQ0) U60.E8(VDDQ1) U60.F4(VDDQ2) U60.F8(VDDQ3) U60.G4(VDDQ4) U60.G8(VDDQ5) U60.H3(VDDQ6) U60.H4(VDDQ7) U60.H8(VDDQ8) U60.H9(VDDQ9) U60.J4(VDDQ10) U60.J8(VDDQ11) U60.K4(VDDQ12) U60.K8(VDDQ13) U60.L4(VDDQ14) U60.L8(VDDQ15) U61.E4(VDDQ0) U61.E8(VDDQ1) U61.F4(VDDQ2) U61.F8(VDDQ3) U61.G4(VDDQ4) U61.G8(VDDQ5) U61.H3(VDDQ6) U61.H4(VDDQ7) U61.H8(VDDQ8) U61.H9(VDDQ9) U61.J4(VDDQ10) U61.J8(VDDQ11) U61.K4(VDDQ12) U61.K8(VDDQ13) U61.L4(VDDQ14) U61.L8(VDDQ15) U62.1(VDDQSNS) U62.2(VLDOIN)
1V8: C592.2 C593.2 C594.2 C595.2 C596.2 C597.2 C598.2 C599.2 C600.2 C602.2 C603.2 C604.2 C605.2 C606.2 C607.2 C608.2 C609.2 C610.2 U60.F5(VDD0) U60.F7(VDD1) U60.G5(VDD2) U60.G7(VDD3) U60.H5(VDD4) U60.H7(VDD5) U60.J5(VDD6) U60.J7(VDD7) U60.K5(VDD8) U60.K7(VDD9) U61.F5(VDD0) U61.F7(VDD1) U61.G5(VDD2) U61.G7(VDD3) U61.H5(VDD4) U61.H7(VDD5) U61.J5(VDD6) U61.J7(VDD7) U61.K5(VDD8) U61.K7(VDD9)
5V: C626.2 R374.1 R375.1 U62.10(VIN)
GND: C572.1 C573.1 C574.1 C575.1 C576.1 C577.1 C578.1 C579.1 C580.1 C582.1 C583.1 C584.1 C585.1 C586.1 C587.1 C588.1 C589.1 C590.1 C592.1 C593.1 C594.1 C595.1 C596.1 C597.1 C598.1 C599.1 C600.1 C602.1 C603.1 C604.1 C605.1 C606.1 C607.1 C608.1 C609.1 C610.1 C612.1 C613.1 C614.1 C615.1 C616.1 C617.1 C618.1 C619.1 C620.1 C621.1 C622.1 C623.1 C624.1 C625.1 C626.1 C627.1 C628.1 C629.1 C630.1 C631.1 R309.2 R310.2 R311.2 R312.2 R313.2 R314.2 R315.2 R316.2 R371.2 R372.2 U60.C4(VSS0) U60.C8(VSS1) U60.D4(VSS2) U60.D5(VSS3) U60.D6(VSS4) U60.D7(VSS5) U60.D8(VSS6) U60.E5(VSS7) U60.E6(VSS8) U60.E7(VSS9) U60.F6(VSS10) U60.G6(VSS11) U60.H6(VSS12) U60.J6(VSS13) U60.K6(VSS14) U60.L5(VSS15) U60.L6(VSS16) U60.L7(VSS17) U60.M4(VSS18) U60.M5(VSS19) U60.M6(VSS20) U60.M7(VSS21) U60.M8(VSS22) U60.N4(VSS23) U60.N8(VSS24) U60.R6(ODT) U61.C4(VSS0) U61.C8(VSS1) U61.D4(VSS2) U61.D5(VSS3) U61.D6(VSS4) U61.D7(VSS5) U61.D8(VSS6) U61.E5(VSS7) U61.E6(VSS8) U61.E7(VSS9) U61.F6(VSS10) U61.G6(VSS11) U61.H6(VSS12) U61.J6(VSS13) U61.K6(VSS14) U61.L5(VSS15) U61.L6(VSS16) U61.L7(VSS17) U61.M4(VSS18) U61.M5(VSS19) U61.M6(VSS20) U61.M7(VSS21) U61.M8(VSS22) U61.N4(VSS23) U61.N8(VSS24) U61.R6(ODT) U62.4(PGND) U62.8(GND) U62.11(PPAD)
QDR23_VREF: C629.2 U60.H2(VREF1) U60.H10(VREF0) U61.H2(VREF1) U61.H10(VREF0) U62.6(VTTREF)
QDR23_VTT: C612.2 C613.2 C614.2 C615.2 C616.2 C617.2 C618.2 C619.2 C620.2 C621.2 C622.2 C623.2 C624.2 C625.2 C630.2 C631.2 R278.2 R279.2 R280.2 R281.2 R282.2 R283.2 R373.1 RP17.5 RP17.6 RP17.7 RP17.8 RP18.5 RP18.6 RP18.7 RP18.8 RP19.5 RP19.6 RP19.7 RP19.8 RP20.5 RP20.6 RP20.7 RP20.8 RP21.5 RP21.6 RP21.7 RP21.8 RP22.5 RP22.6 RP22.7 RP22.8 RP23.5 RP23.6 RP23.7 RP23.8 RP24.5 RP24.6 RP24.7 RP24.8 RP25.5 RP25.6 RP25.7 RP25.8 RP26.5 RP26.6 RP26.7 RP26.8 U62.3(VTT)
QDR2.A0: RP19.1 U60.B4(A0)
QDR2.A1: RP24.3 U60.B8(A1)
QDR2.A2: R282.1 U60.C5(A2)
QDR2.A3: R280.1 U60.C7(A3)
QDR2.A4: RP23.2 U60.N5(A4)
QDR2.A5: RP23.3 U60.N6(A5)
QDR2.A6: RP23.4 U60.N7(A6)
QDR2.A7: RP18.2 U60.P4(A7)
QDR2.A8: RP18.4 U60.P5(A8)
QDR2.A9: RP17.1 U60.P7(A9)
QDR2.A10: RP17.3 U60.P8(A10)
QDR2.A11: RP24.2 U60.A9(A11)
QDR2.A12: RP18.1 U60.R3(A12)
QDR2.A13: RP18.3 U60.R4(A13)
QDR2.A14: RP23.1 U60.R5(A14)
QDR2.A15: R278.1 U60.R7(A15)
QDR2.A16: RP17.2 U60.R8(A16)
QDR2.A17: RP17.4 U60.R9(A17)
QDR2.A18: RP19.3 U60.A3(A18)
QDR2.A19: RP24.1 U60.A10(A19)
QDR2.A20: RP19.4 U60.A2(A20)
QDR2.BWn0: R309.1 U60.B7(BWS#0)
QDR2.BWn1: R310.1 U60.A7(BWS#1)
QDR2.BWn2: R311.1 U60.A5(BWS#2)
QDR2.BWn3: R312.1 U60.B5(BWS#3)
QDR2.D0: U60.P10(D0)
QDR2.D1: U60.N11(D1)
QDR2.D2: U60.M11(D2)
QDR2.D3: U60.K10(D3)
QDR2.D4: U60.J11(D4)
QDR2.D5: U60.G11(D5)
QDR2.D6: U60.E10(D6)
QDR2.D7: U60.D11(D7)
QDR2.D8: U60.C11(D8)
QDR2.D9: U60.N10(D9)
QDR2.D10: U60.M9(D10)
QDR2.D11: U60.L9(D11)
QDR2.D12: U60.J9(D12)
QDR2.D13: U60.G10(D13)
QDR2.D14: U60.F9(D14)
QDR2.D15: U60.D10(D15)
QDR2.D16: U60.C9(D16)
QDR2.D17: U60.B9(D17)
QDR2.D18: U60.B3(D18)
QDR2.D19: U60.C3(D19)
QDR2.D20: U60.D2(D20)
QDR2.D21: U60.F3(D21)
QDR2.D22: U60.G2(D22)
QDR2.D23: U60.J3(D23)
QDR2.D24: U60.L3(D24)
QDR2.D25: U60.M3(D25)
QDR2.D26: U60.N2(D26)
QDR2.D27: U60.C1(D27)
QDR2.D28: U60.D1(D28)
QDR2.D29: U60.E2(D29)
QDR2.D30: U60.G1(D30)
QDR2.D31: U60.J1(D31)
QDR2.D32: U60.K2(D32)
QDR2.D33: U60.M1(D33)
QDR2.D34: U60.N1(D34)
QDR2.D35: U60.P2(D35)
QDR2.DOFFn: U60.H1(DOFF#) ; port QDR2.DOFFn
QDR2.K: U60.B6(K) ; port QDR2.K
QDR2.Kn: U60.A6(K#) ; port QDR2.Kn
QDR2.Q0: U60.P11(Q0)
QDR2.Q1: U60.M10(Q1)
QDR2.Q2: U60.L11(Q2)
QDR2.Q3: U60.K11(Q3)
QDR2.Q4: U60.J10(Q4)
QDR2.Q5: U60.F11(Q5)
QDR2.Q6: U60.E11(Q6)
QDR2.Q7: U60.C10(Q7)
QDR2.Q8: U60.B11(Q8)
QDR2.Q9: U60.P9(Q9)
QDR2.Q10: U60.N9(Q10)
QDR2.Q11: U60.L10(Q11)
QDR2.Q12: U60.K9(Q12)
QDR2.Q13: U60.G9(Q13)
QDR2.Q14: U60.F10(Q14)
QDR2.Q15: U60.E9(Q15)
QDR2.Q16: U60.D9(Q16)
QDR2.Q17: U60.B10(Q17)
QDR2.Q18: U60.B2(Q18)
QDR2.Q19: U60.D3(Q19)
QDR2.Q20: U60.E3(Q20)
QDR2.Q21: U60.F2(Q21)
QDR2.Q22: U60.G3(Q22)
QDR2.Q23: U60.K3(Q23)
QDR2.Q24: U60.L2(Q24)
QDR2.Q25: U60.N3(Q25)
QDR2.Q26: U60.P3(Q26)
QDR2.Q27: U60.B1(Q27)
QDR2.Q28: U60.C2(Q28)
QDR2.Q29: U60.E1(Q29)
QDR2.Q30: U60.F1(Q30)
QDR2.Q31: U60.J2(Q31)
QDR2.Q32: U60.K1(Q32)
QDR2.Q33: U60.L1(Q33)
QDR2.Q34: U60.M2(Q34)
QDR2.Q35: U60.P1(Q35)
QDR2.RDn: RP24.4 U60.A8(RPS#) ; port QDR2.RDn
QDR2.WRn: RP19.2 U60.A4(WPS#) ; port QDR2.WRn
QDR2_TCK: U60.R2(TCK) ; port QDR2_TCK
QDR2_TDI: U60.R11(TDI) ; port QDR2_TDI
QDR2_TDO: U60.R1(TDO) ; port QDR2_TDO
QDR2_TMS: U60.R10(TMS) ; port QDR2_TMS
QDR3.A0: RP22.1 U61.B4(A0)
QDR3.A1: RP26.3 U61.B8(A1)
QDR3.A2: R283.1 U61.C5(A2)
QDR3.A3: R281.1 U61.C7(A3)
QDR3.A4: RP25.2 U61.N5(A4)
QDR3.A5: RP25.3 U61.N6(A5)
QDR3.A6: RP25.4 U61.N7(A6)
QDR3.A7: RP21.2 U61.P4(A7)
QDR3.A8: RP21.4 U61.P5(A8)
QDR3.A9: RP20.1 U61.P7(A9)
QDR3.A10: RP20.3 U61.P8(A10)
QDR3.A11: RP26.2 U61.A9(A11)
QDR3.A12: RP21.1 U61.R3(A12)
QDR3.A13: RP21.3 U61.R4(A13)
QDR3.A14: RP25.1 U61.R5(A14)
QDR3.A15: R279.1 U61.R7(A15)
QDR3.A16: RP20.2 U61.R8(A16)
QDR3.A17: RP20.4 U61.R9(A17)
QDR3.A18: RP22.3 U61.A3(A18)
QDR3.A19: RP26.1 U61.A10(A19)
QDR3.A20: RP22.4 U61.A2(A20)
QDR3.BWn0: R313.1 U61.B7(BWS#0)
QDR3.BWn1: R314.1 U61.A7(BWS#1)
QDR3.BWn2: R315.1 U61.A5(BWS#2)
QDR3.BWn3: R316.1 U61.B5(BWS#3)
QDR3.D0: U61.P10(D0)
QDR3.D1: U61.N11(D1)
QDR3.D2: U61.M11(D2)
QDR3.D3: U61.K10(D3)
QDR3.D4: U61.J11(D4)
QDR3.D5: U61.G11(D5)
QDR3.D6: U61.E10(D6)
QDR3.D7: U61.D11(D7)
QDR3.D8: U61.C11(D8)
QDR3.D9: U61.N10(D9)
QDR3.D10: U61.M9(D10)
QDR3.D11: U61.L9(D11)
QDR3.D12: U61.J9(D12)
QDR3.D13: U61.G10(D13)
QDR3.D14: U61.F9(D14)
QDR3.D15: U61.D10(D15)
QDR3.D16: U61.C9(D16)
QDR3.D17: U61.B9(D17)
QDR3.D18: U61.B3(D18)
QDR3.D19: U61.C3(D19)
QDR3.D20: U61.D2(D20)
QDR3.D21: U61.F3(D21)
QDR3.D22: U61.G2(D22)
QDR3.D23: U61.J3(D23)
QDR3.D24: U61.L3(D24)
QDR3.D25: U61.M3(D25)
QDR3.D26: U61.N2(D26)
QDR3.D27: U61.C1(D27)
QDR3.D28: U61.D1(D28)
QDR3.D29: U61.E2(D29)
QDR3.D30: U61.G1(D30)
QDR3.D31: U61.J1(D31)
QDR3.D32: U61.K2(D32)
QDR3.D33: U61.M1(D33)
QDR3.D34: U61.N1(D34)
QDR3.D35: U61.P2(D35)
QDR3.DOFFn: U61.H1(DOFF#) ; port QDR3.DOFFn
QDR3.K: U61.B6(K) ; port QDR3.K
QDR3.Kn: U61.A6(K#) ; port QDR3.Kn
QDR3.Q0: U61.P11(Q0)
QDR3.Q1: U61.M10(Q1)
QDR3.Q2: U61.L11(Q2)
QDR3.Q3: U61.K11(Q3)
QDR3.Q4: U61.J10(Q4)
QDR3.Q5: U61.F11(Q5)
QDR3.Q6: U61.E11(Q6)
QDR3.Q7: U61.C10(Q7)
QDR3.Q8: U61.B11(Q8)
QDR3.Q9: U61.P9(Q9)
QDR3.Q10: U61.N9(Q10)
QDR3.Q11: U61.L10(Q11)
QDR3.Q12: U61.K9(Q12)
QDR3.Q13: U61.G9(Q13)
QDR3.Q14: U61.F10(Q14)
QDR3.Q15: U61.E9(Q15)
QDR3.Q16: U61.D9(Q16)
QDR3.Q17: U61.B10(Q17)
QDR3.Q18: U61.B2(Q18)
QDR3.Q19: U61.D3(Q19)
QDR3.Q20: U61.E3(Q20)
QDR3.Q21: U61.F2(Q21)
QDR3.Q22: U61.G3(Q22)
QDR3.Q23: U61.K3(Q23)
QDR3.Q24: U61.L2(Q24)
QDR3.Q25: U61.N3(Q25)
QDR3.Q26: U61.P3(Q26)
QDR3.Q27: U61.B1(Q27)
QDR3.Q28: U61.C2(Q28)
QDR3.Q29: U61.E1(Q29)
QDR3.Q30: U61.F1(Q30)
QDR3.Q31: U61.J2(Q31)
QDR3.Q32: U61.K1(Q32)
QDR3.Q33: U61.L1(Q33)
QDR3.Q34: U61.M2(Q34)
QDR3.Q35: U61.P1(Q35)
QDR3.RDn: RP26.4 U61.A8(RPS#) ; port QDR3.RDn
QDR3.WRn: RP22.2 U61.A4(WPS#) ; port QDR3.WRn
QDR3_TCK: U61.R2(TCK) ; port QDR3_TCK
QDR3_TDI: U61.R11(TDI) ; port QDR3_TDI
QDR3_TDO: U61.R1(TDO) ; port QDR3_TDO
QDR3_TMS: U61.R10(TMS) ; port QDR3_TMS
NetC628_2: C628.2 R373.2 U62.5(VTTSNS)
NetR371_1: R371.1 U60.H11(ZQ)
NetR372_1: R372.1 U61.H11(ZQ)
NetR374_2: R374.2 U62.7(S3)
NetR375_2: R375.2 U62.9(S5)
NetTP18_1: TP18.1 U60.P6(QVLD)
NetTP19_1: TP19.1 U61.P6(QVLD)
NetTP20_1: TP20.1 U60.A11(CQ)
NetTP21_1: TP21.1 U61.A11(CQ)

Not connected (* = marked no-connect by the designer): U60 A1(CQ#)* C6(NC1)*; U61 A1(CQ#)* C6(NC1)*

### Buses and harness runs
bus QDR2.A[20..0]
bus QDR2.D[35..0]
bus QDR2.Q[35..0]
bus QDR3.A[20..0]
bus QDR3.D[35..0]
bus QDR3.Q[35..0]

### Notes on the sheet
- (near R371) Low: 175 < RQ < 350
- (near R372) Low: 175 < RQ < 350
- Route as seperate trace from centre of the VTT island
- Place Regulator between both VTT islands
- 2009   THIS DOCUMENT IS THE PROPERTY OF THE OWNER, AND MAY NOT BE COPIED OR USED FOR ANY PURPOSE OTHER THAN THAT FOR WHICH IT IS SUPPLIED WITHOUT PERMISSION IN WRITING FROM THE OWNER.
- C
- DATESTAMP OF THIS PRINT
- DRAWN BY:
- DOCUMENT NUMBER:
- SCHEMATIC FILENAME:
- PCB FILENAME:
- ENGINEER:
- APPROVED:
- CIRCUIT DIAGRAM
- DATE
- SHEET
- REVISION
- OF
- (in symbol IC-MEM-1, part A) QDR DATA
- (in symbol IC-MEM-1, part B) QDR POWER
- (in symbol IC-MEM-1, part C) QDR JTAG
- (in symbol IC-MEM-1, part D) QDR NC

### Library data of the parts
C572 C582 C592 C593 C602 C603 C626 = CAP-CER-3: as C512 on sheet qdr0_1; POD number: CAP-CER-3; Value: 4.7uF; RoHS: Y; Sort Value: 4.7; Category: Capacitors; Subcategory: Ceramic
C573-C580 C583-C590 C594-C600 C604-C610 C629 = CAP-CER-1: as C513-C520 on sheet qdr0_1; POD number: CAP-CER-1; Value: 0.1uF; RoHS: Y; Sort Value: 0.1; Category: Capacitors; Subcategory: Ceramic
C612 C619 C627 C630 C631 = CAP-CER-5: as C567 on sheet qdr0_1; POD number: CAP-CER-5; Value: 10uF; RoHS: Y; Sort Value: 100; Category: Capacitors; Subcategory: Ceramic
C613-C618 C620-C625 = CAP-CER-7: as C553 on sheet qdr0_1; POD number: CAP-CER-7; Value: 0.47uF; RoHS: Y; Sort Value: 0.47; Category: Capacitors; Subcategory: Ceramic
C628 = CAP-CER-4: as C568 on sheet qdr0_1; POD number: CAP-CER-4; Value: 1000pF; RoHS: Y; Sort Value: 0.0001; Category: Capacitors; Subcategory: Ceramic
R278-R283 = RES-TF-10: as R114 on sheet qdr0_1; POD number: RES-TF-10; Value: 49R9; Sort Value: 49.9; Category: Resistors; Subcategory: ThickFilm; HelpURL: *.pdf
R309-R316 = RES-TF-0: as R301-R308 on sheet qdr0_1; POD number: RES-TF-0; Value: 0R; Sort Value: 0; Category: Resistors; Subcategory: ThickFilm; HelpURL: *.pdf
R371 R372 = RES-TF-15: as R320 on sheet qdr0_1; POD number: RES-TF-15; Value: 249R; Sort Value: 249; Category: Resistors; Subcategory: ThickFilm; HelpURL: *.pdf
R373 = RES-TF-14: as R322 on sheet qdr0_1; POD number: RES-TF-14; Value: 100R; Sort Value: 1000; Category: Resistors; Subcategory: ThickFilm; HelpURL: *.pdf
R374 R375 = RES-TF-5: as R323 on sheet qdr0_1; POD number: RES-TF-5; Value: 10K; Sort Value: 10000; Category: Resistors; Subcategory: ThickFilm; HelpURL: *.pdf
RP17-RP26 = RES-TF-39: as RP7 on sheet qdr0_1; POD number: RES-TF-39; Value: 49R9; Sort Value: 49.9; Category: Resistors; Subcategory: ThickFilm
TP18-TP21 = ELMECH-TP-0: as TP12-TP15 on sheet qdr0_1; POD number: ELMECH-TP-0; RoHS: Y; Category: ELMECH; Subcategory: Test Points
U60 U61 = IC-MEM-1: as U57 on sheet qdr0_1; POD number: IC-MEM-1; RoHS: Y; Category: IC; Subcategory: Memory
U62 = IC-REG-6: as U59 on sheet qdr0_1; POD number: IC-REG-6; PartNum: TPS51100DGQ; RoHS: Y; Category: IC; Subcategory: Regulators

## Sheet v6_config_io_16_17_21_22.SchDoc: Virtex-6 IO Banks 16, 17, 21 & 22
size A3; Date: DO NOT USE, RATHER USE PROJ OPTIONS; DrawnBy: DO NOT USE, RATHER USE PROJ OPTIONS; Engineer: DO NOT USE, RATHER USE PROJ OPTIONS; Organization: DO NOT USE, RATHER USE PROJ OPTIONS; DocumentNumber: DO NOT USE, RATHER USE PROJ OPTIONS; Revision: DO NOT USE, RATHER USE PROJ OPTIONS; SheetNumber: 13; SheetTotal: 27; SCH_Sheet_Filename: v6_config_io_16_17_21_22...; CurrentTime: DO NOT USE, RATHER USE PROJ OPTIONS; Time: DO NOT USE, RATHER USE PROJ OPTIONS; DocumentFullPathAndName: DO NOT USE, RATHER USE PROJ OPTIONS; DocumentName: DO NOT USE, RATHER USE PROJ OPTIONS; ModifiedDate: DO NOT USE, RATHER USE PROJ OPTIONS; ImagePath: DO NOT USE, RATHER USE PROJ OPTIONS
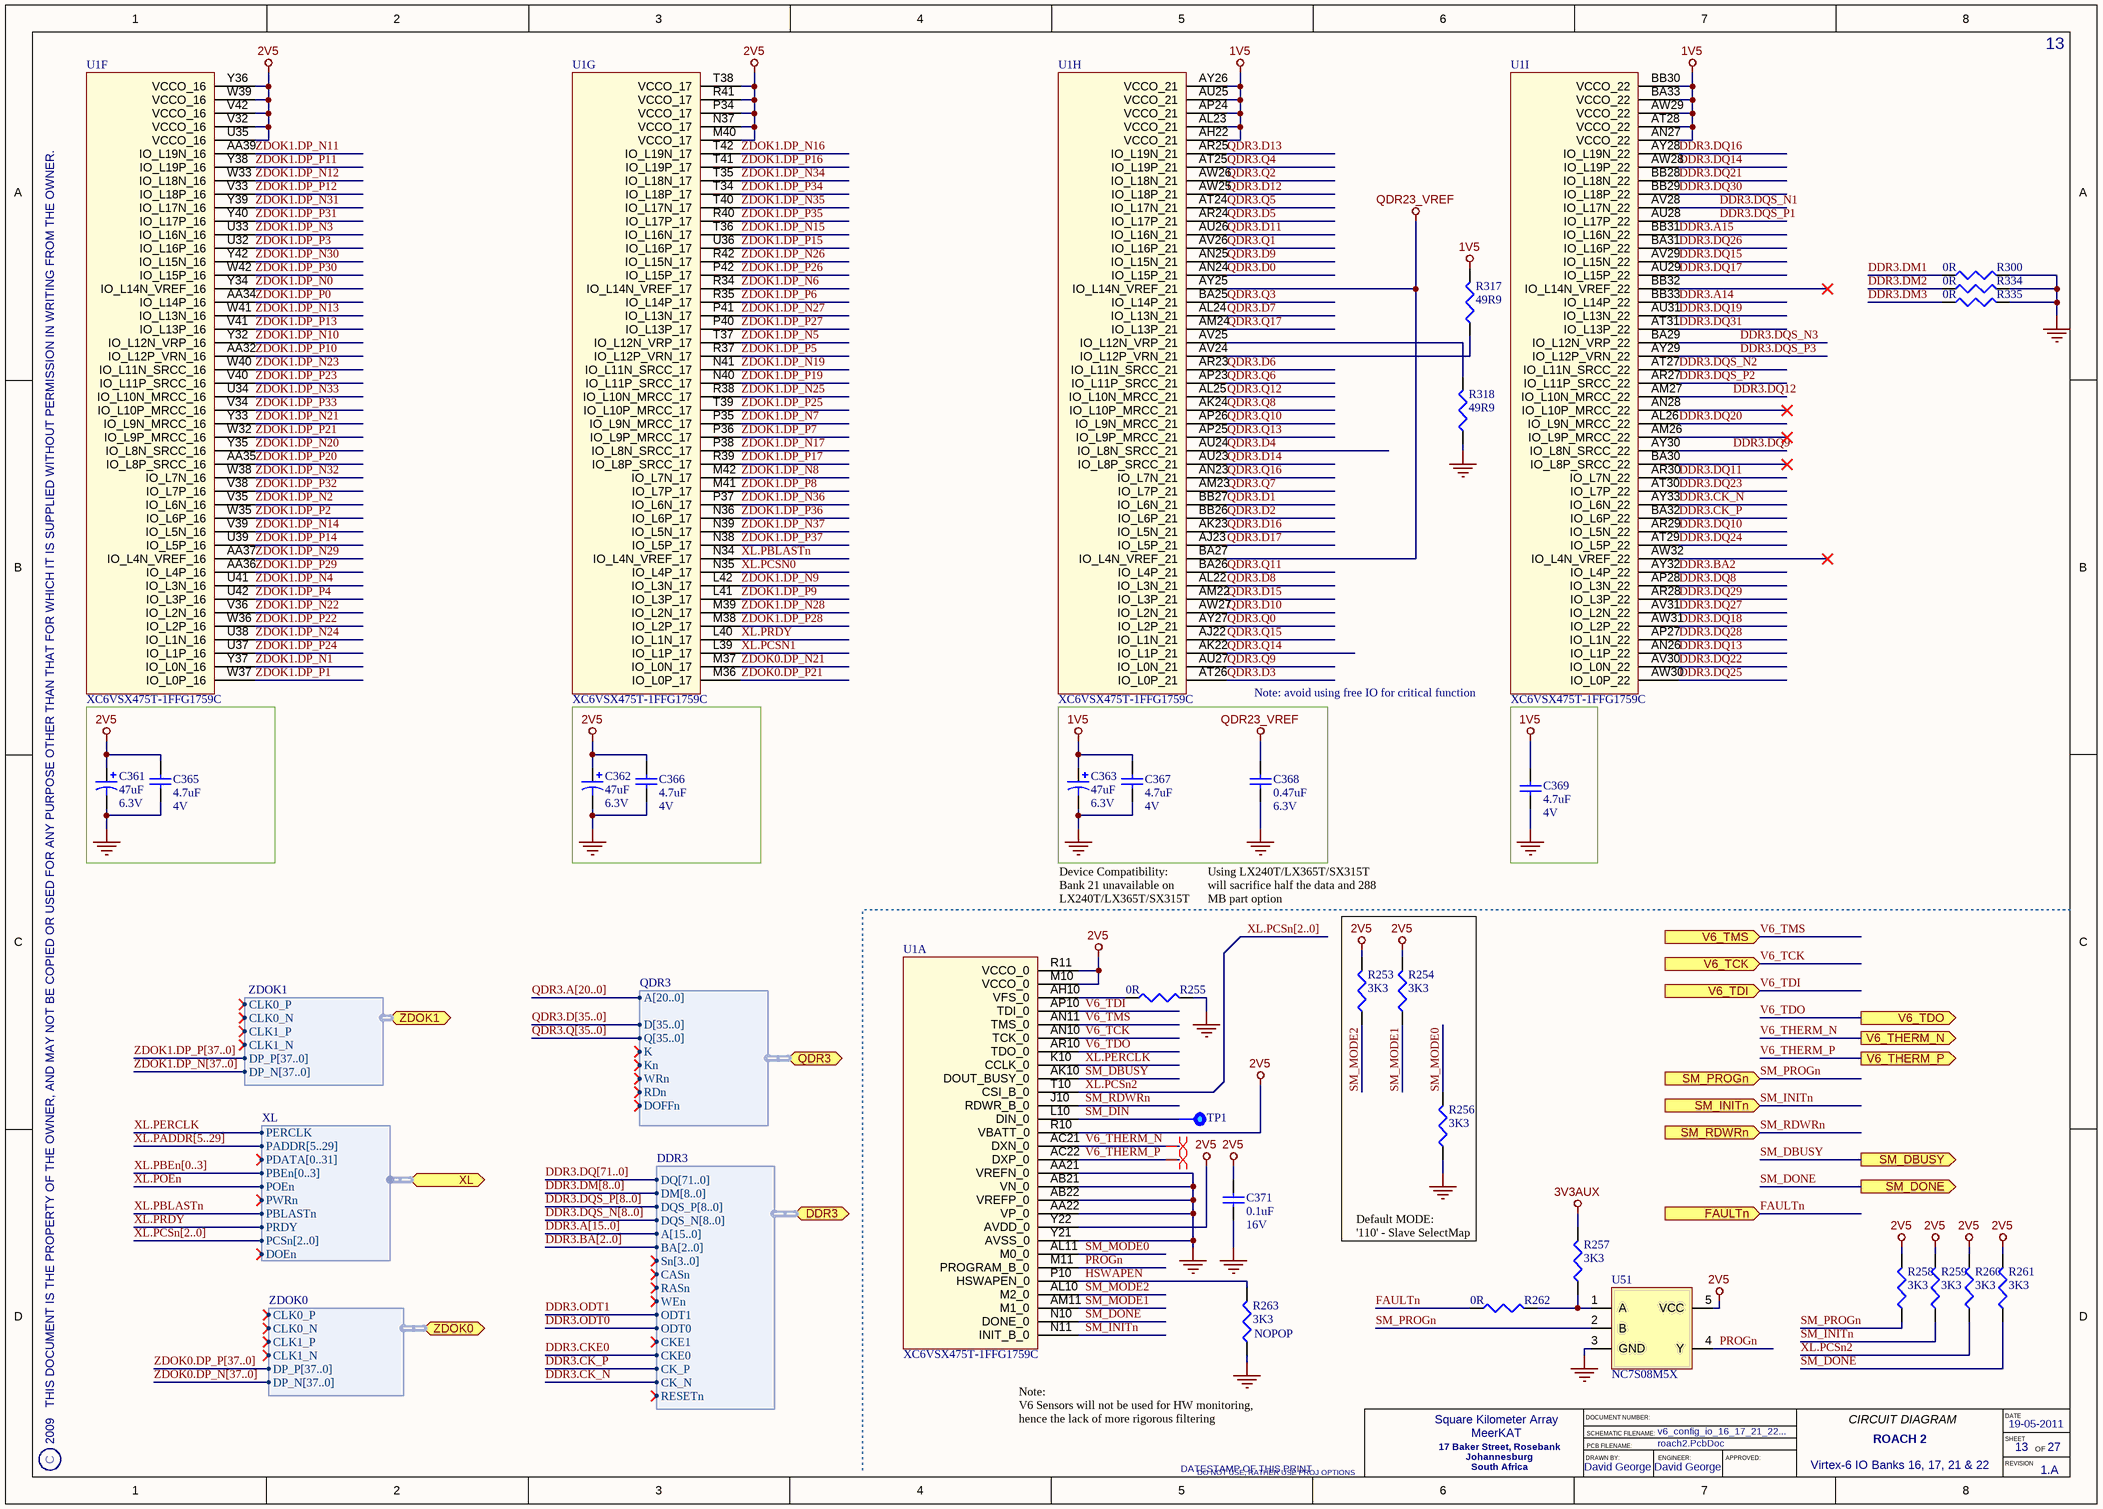
[diagram p13: v6_config_io_16_17_21_22.SchDoc]

### Parts
C361  Rating: 6.3V  [CAPMP3528X120L]  (hidden comment: 47uF)
C362  Rating: 6.3V  [CAPMP3528X120L]  (hidden comment: 47uF)
C363  Rating: 6.3V  [CAPMP3528X120L]  (hidden comment: 47uF)
C365  Rating: 4V  [CAPC1005X60L]  (hidden comment: 4.7uF)
C366  Rating: 4V  [CAPC1005X60L]  (hidden comment: 4.7uF)
C367  Rating: 4V  [CAPC1005X60L]  (hidden comment: 4.7uF)
C368  Rating: 6.3V  [CAPC1005X55L]  (hidden comment: 0.47uF)
C369  Rating: 4V  [CAPC1005X60L]  (hidden comment: 4.7uF)
C371  Rating: 16V  [CAPC1005X60L]  (hidden comment: 0.1uF)
R253  3K3  [RESC1005X40L]
R254  3K3  [RESC1005X40L]
R255  0R  [RESC1005X40L]
R256  3K3  [RESC1005X40L]
R257  3K3  [RESC1005X40L]
R258  3K3  [RESC1005X40L]
R259  3K3  [RESC1005X40L]
R260  3K3  [RESC1005X40L]
R261  3K3  [RESC1005X40L]
R262  0R  [RESC1005X40L]
R263  3K3  [RESC1005X40L]
R300  0R  [RESC1005X40L]
R317  49R9  [RESC1005X40L]
R318  49R9  [RESC1005X40L]
R334  0R  [RESC1005X40L]
R335  0R  [RESC1005X40L]
TP1  Testpoint  [TP100]  (value not drawn)  (no BOM)
U1  XC6VSX475T-1FFG1759C  [FFG1759]  (parts A,F,G,H,I of 39)
U51  NC7S08M5X  [SOT23-5]

### Blocks framed on the sheet
Note: avoid using free IO for critical function: C363 C367 C368

### Ports
DDR3 (harness DDR3), FAULTn (in), QDR3 (harness QDR3), SM_DBUSY (out), SM_DONE (out), SM_INITn (in), SM_PROGn (in), SM_RDWRn (in), V6_TCK (in), V6_TDI (in), V6_TDO (out), V6_THERM_N (out), V6_THERM_P (out), V6_TMS (in), XL (harness XL), ZDOK0 (harness ZDOK0), ZDOK1 (harness ZDOK1)

### Harnesses
ZDOK1: CLK0_P, CLK0_N, CLK1_P, CLK1_N, DP_P[37..0], DP_N[37..0]
QDR3: A[20..0], D[35..0], Q[35..0], K, Kn, WRn, RDn, DOFFn
DDR3: DQ[71..0], DM[8..0], DQS_P[8..0], DQS_N[8..0], A[15..0], BA[2..0], Sn[3..0], CASn, RASn, WEn, ODT1, ODT0, CKE1, CKE0, CK_P, CK_N, RESETn
XL: PERCLK, PADDR[5..29], PDATA[0..31], PBEn[0..3], POEn, PWRn, PBLASTn, PRDY, PCSn[2..0], DOEn
ZDOK0: CLK0_P, CLK0_N, CLK1_P, CLK1_N, DP_P[37..0], DP_N[37..0]

### Nets
1V5: C363.1 C367.2 C369.2 R317.2 U1.AH22(VCCO_21) U1.AL23(VCCO_21) U1.AN27(VCCO_22) U1.AP24(VCCO_21) U1.AT28(VCCO_22) U1.AU25(VCCO_21) U1.AW29(VCCO_22) U1.AY26(VCCO_21) U1.BA33(VCCO_22) U1.BB30(VCCO_22)
2V5: C361.1 C362.1 C365.2 C366.2 C371.2 R253.2 R254.2 R258.2 R259.2 R260.2 R261.2 U1.M10(VCCO_0) U1.M40(VCCO_17) U1.N37(VCCO_17) U1.P34(VCCO_17) U1.R10(VBATT_0) U1.R11(VCCO_0) U1.R41(VCCO_17) U1.T38(VCCO_17) U1.U35(VCCO_16) U1.V32(VCCO_16) U1.V42(VCCO_16) U1.W39(VCCO_16) U1.Y22(AVDD_0) U1.Y36(VCCO_16) U51.5(VCC)
3V3AUX: R257.2
GND: C361.2 C362.2 C363.2 C365.1 C366.1 C367.1 C368.1 C369.1 C371.1 R255.2 R256.1 R263.1 R300.2 R318.1 R334.2 R335.2 U1.AA21(VREFN_0) U1.AA22(VP_0) U1.AB21(VN_0) U1.AB22(VREFP_0) U1.Y21(AVSS_0) U51.3(GND)
QDR23_VREF: C368.2 U1.AY25(IO_L14N_VREF_21) U1.BA27(IO_L4N_VREF_21)
DDR3.A14: U1.BB33(IO_L14P_22)
DDR3.A15: U1.BB31(IO_L16N_22)
DDR3.BA2: U1.AY32(IO_L4P_22)
DDR3.CK_N: U1.AY33(IO_L6N_22) ; port DDR3.CK_N
DDR3.CK_P: U1.BA32(IO_L6P_22) ; port DDR3.CK_P
DDR3.DM1: R300.1
DDR3.DM2: R334.1
DDR3.DM3: R335.1
DDR3.DQ8: U1.AP28(IO_L3N_22)
DDR3.DQ9: U1.AY30(IO_L8N_SRCC_22)
DDR3.DQ10: U1.AR29(IO_L5N_22)
DDR3.DQ11: U1.AR30(IO_L7N_22)
DDR3.DQ12: U1.AM27(IO_L10N_MRCC_22)
DDR3.DQ13: U1.AN26(IO_L1P_22)
DDR3.DQ14: U1.AW28(IO_L19P_22)
DDR3.DQ15: U1.AV29(IO_L15N_22)
DDR3.DQ16: U1.AY28(IO_L19N_22)
DDR3.DQ17: U1.AU29(IO_L15P_22)
DDR3.DQ18: U1.AW31(IO_L2P_22)
DDR3.DQ19: U1.AU31(IO_L13N_22)
DDR3.DQ20: U1.AL26(IO_L9N_MRCC_22)
DDR3.DQ21: U1.BB28(IO_L18N_22)
DDR3.DQ22: U1.AV30(IO_L0N_22)
DDR3.DQ23: U1.AT30(IO_L7P_22)
DDR3.DQ24: U1.AT29(IO_L5P_22)
DDR3.DQ25: U1.AW30(IO_L0P_22)
DDR3.DQ26: U1.BA31(IO_L16P_22)
DDR3.DQ27: U1.AV31(IO_L2N_22)
DDR3.DQ28: U1.AP27(IO_L1N_22)
DDR3.DQ29: U1.AR28(IO_L3P_22)
DDR3.DQ30: U1.BB29(IO_L18P_22)
DDR3.DQ31: U1.AT31(IO_L13P_22)
DDR3.DQS_N1: U1.AV28(IO_L17N_22)
DDR3.DQS_N2: U1.AT27(IO_L11N_SRCC_22)
DDR3.DQS_N3: U1.BA29(IO_L12N_VRP_22)
DDR3.DQS_P1: U1.AU28(IO_L17P_22)
DDR3.DQS_P2: U1.AR27(IO_L11P_SRCC_22)
DDR3.DQS_P3: U1.AY29(IO_L12P_VRN_22)
FAULTn: R262.1 ; port FAULTn
HSWAPEN: R263.2 U1.P10(HSWAPEN_0)
PROGn: U1.M11(PROGRAM_B_0) U51.4(Y)
QDR3.D0: U1.AN24(IO_L15P_21)
QDR3.D1: U1.BB27(IO_L6N_21)
QDR3.D2: U1.BB26(IO_L6P_21)
QDR3.D3: U1.AT26(IO_L0P_21)
QDR3.D4: U1.AU24(IO_L8N_SRCC_21)
QDR3.D5: U1.AR24(IO_L17P_21)
QDR3.D6: U1.AR23(IO_L11N_SRCC_21)
QDR3.D7: U1.AL24(IO_L13N_21)
QDR3.D8: U1.AL22(IO_L3N_21)
QDR3.D9: U1.AN25(IO_L15N_21)
QDR3.D10: U1.AW27(IO_L2N_21)
QDR3.D11: U1.AU26(IO_L16N_21)
QDR3.D12: U1.AW25(IO_L18P_21)
QDR3.D13: U1.AR25(IO_L19N_21)
QDR3.D14: U1.AU23(IO_L8P_SRCC_21)
QDR3.D15: U1.AM22(IO_L3P_21)
QDR3.D16: U1.AK23(IO_L5N_21)
QDR3.D17: U1.AJ23(IO_L5P_21)
QDR3.Q0: U1.AY27(IO_L2P_21)
QDR3.Q1: U1.AV26(IO_L16P_21)
QDR3.Q2: U1.AW26(IO_L18N_21)
QDR3.Q3: U1.BA25(IO_L14P_21)
QDR3.Q4: U1.AT25(IO_L19P_21)
QDR3.Q5: U1.AT24(IO_L17N_21)
QDR3.Q6: U1.AP23(IO_L11P_SRCC_21)
QDR3.Q7: U1.AM23(IO_L7P_21)
QDR3.Q8: U1.AK24(IO_L10P_MRCC_21)
QDR3.Q9: U1.AU27(IO_L0N_21)
QDR3.Q10: U1.AP26(IO_L9N_MRCC_21)
QDR3.Q11: U1.BA26(IO_L4P_21)
QDR3.Q12: U1.AL25(IO_L10N_MRCC_21)
QDR3.Q13: U1.AP25(IO_L9P_MRCC_21)
QDR3.Q14: U1.AK22(IO_L1P_21)
QDR3.Q15: U1.AJ22(IO_L1N_21)
QDR3.Q16: U1.AN23(IO_L7N_21)
QDR3.Q17: U1.AM24(IO_L13P_21)
SM_DBUSY: U1.AK10(DOUT_BUSY_0) ; port SM_DBUSY
SM_DIN: TP1.1 U1.L10(DIN_0)
SM_DONE: R261.1 U1.N10(DONE_0) ; port SM_DONE
SM_INITn: R259.1 U1.N11(INIT_B_0) ; port SM_INITn
SM_MODE0: R256.2 U1.AL11(M0_0)
SM_MODE1: R254.1 U1.AM11(M1_0)
SM_MODE2: R253.1 U1.AL10(M2_0)
SM_PROGn: R258.1 U51.2(B) ; port SM_PROGn
SM_RDWRn: U1.J10(RDWR_B_0) ; port SM_RDWRn
V6_TCK: U1.AN10(TCK_0) ; port V6_TCK
V6_TDI: U1.AP10(TDI_0) ; port V6_TDI
V6_TDO: U1.AR10(TDO_0) ; port V6_TDO
V6_THERM_N: U1.AC21(DXN_0) ; port V6_THERM_N
V6_THERM_P: U1.AC22(DXP_0) ; port V6_THERM_P
V6_TMS: U1.AN11(TMS_0) ; port V6_TMS
XL.PBLASTn: U1.N34(IO_L4N_VREF_17) ; port XL.PBLASTn
XL.PCSn0: U1.N35(IO_L4P_17)
XL.PCSn1: U1.L39(IO_L1P_17)
XL.PCSn2: R260.1 U1.T10(CSI_B_0)
XL.PERCLK: U1.K10(CCLK_0) ; port XL.PERCLK
XL.PRDY: U1.L40(IO_L1N_17) ; port XL.PRDY
ZDOK0.DP_N21: U1.M37(IO_L0N_17)
ZDOK0.DP_P21: U1.M36(IO_L0P_17)
ZDOK1.DP_N0: U1.Y34(IO_L14N_VREF_16)
ZDOK1.DP_N1: U1.Y37(IO_L0N_16)
ZDOK1.DP_N2: U1.V35(IO_L6N_16)
ZDOK1.DP_N3: U1.U33(IO_L16N_16)
ZDOK1.DP_N4: U1.U41(IO_L3N_16)
ZDOK1.DP_N5: U1.T37(IO_L12N_VRP_17)
ZDOK1.DP_N6: U1.R34(IO_L14N_VREF_17)
ZDOK1.DP_N7: U1.P35(IO_L9N_MRCC_17)
ZDOK1.DP_N8: U1.M42(IO_L7N_17)
ZDOK1.DP_N9: U1.L42(IO_L3N_17)
ZDOK1.DP_N10: U1.Y32(IO_L12N_VRP_16)
ZDOK1.DP_N11: U1.AA39(IO_L19N_16)
ZDOK1.DP_N12: U1.W33(IO_L18N_16)
ZDOK1.DP_N13: U1.W41(IO_L13N_16)
ZDOK1.DP_N14: U1.V39(IO_L5N_16)
ZDOK1.DP_N15: U1.T36(IO_L16N_17)
ZDOK1.DP_N16: U1.T42(IO_L19N_17)
ZDOK1.DP_N17: U1.P38(IO_L8N_SRCC_17)
ZDOK1.DP_N19: U1.N41(IO_L11N_SRCC_17)
ZDOK1.DP_N20: U1.Y35(IO_L8N_SRCC_16)
ZDOK1.DP_N21: U1.Y33(IO_L9N_MRCC_16)
ZDOK1.DP_N22: U1.V36(IO_L2N_16)
ZDOK1.DP_N23: U1.W40(IO_L11N_SRCC_16)
ZDOK1.DP_N24: U1.U38(IO_L1N_16)
ZDOK1.DP_N25: U1.R38(IO_L10N_MRCC_17)
ZDOK1.DP_N26: U1.R42(IO_L15N_17)
ZDOK1.DP_N27: U1.P41(IO_L13N_17)
ZDOK1.DP_N28: U1.M39(IO_L2N_17)
ZDOK1.DP_N29: U1.AA37(IO_L4N_VREF_16)
ZDOK1.DP_N30: U1.Y42(IO_L15N_16)
ZDOK1.DP_N31: U1.Y39(IO_L17N_16)
ZDOK1.DP_N32: U1.W38(IO_L7N_16)
ZDOK1.DP_N33: U1.U34(IO_L10N_MRCC_16)
ZDOK1.DP_N34: U1.T35(IO_L18N_17)
ZDOK1.DP_N35: U1.T40(IO_L17N_17)
ZDOK1.DP_N36: U1.P37(IO_L6N_17)
ZDOK1.DP_N37: U1.N39(IO_L5N_17)
ZDOK1.DP_P0: U1.AA34(IO_L14P_16)
ZDOK1.DP_P1: U1.W37(IO_L0P_16)
ZDOK1.DP_P2: U1.W35(IO_L6P_16)
ZDOK1.DP_P3: U1.U32(IO_L16P_16)
ZDOK1.DP_P4: U1.U42(IO_L3P_16)
ZDOK1.DP_P5: U1.R37(IO_L12P_VRN_17)
ZDOK1.DP_P6: U1.R35(IO_L14P_17)
ZDOK1.DP_P7: U1.P36(IO_L9P_MRCC_17)
ZDOK1.DP_P8: U1.M41(IO_L7P_17)
ZDOK1.DP_P9: U1.L41(IO_L3P_17)
ZDOK1.DP_P10: U1.AA32(IO_L12P_VRN_16)
ZDOK1.DP_P11: U1.Y38(IO_L19P_16)
ZDOK1.DP_P12: U1.V33(IO_L18P_16)
ZDOK1.DP_P13: U1.V41(IO_L13P_16)
ZDOK1.DP_P14: U1.U39(IO_L5P_16)
ZDOK1.DP_P15: U1.U36(IO_L16P_17)
ZDOK1.DP_P16: U1.T41(IO_L19P_17)
ZDOK1.DP_P17: U1.R39(IO_L8P_SRCC_17)
ZDOK1.DP_P19: U1.N40(IO_L11P_SRCC_17)
ZDOK1.DP_P20: U1.AA35(IO_L8P_SRCC_16)
ZDOK1.DP_P21: U1.W32(IO_L9P_MRCC_16)
ZDOK1.DP_P22: U1.W36(IO_L2P_16)
ZDOK1.DP_P23: U1.V40(IO_L11P_SRCC_16)
ZDOK1.DP_P24: U1.U37(IO_L1P_16)
ZDOK1.DP_P25: U1.T39(IO_L10P_MRCC_17)
ZDOK1.DP_P26: U1.P42(IO_L15P_17)
ZDOK1.DP_P27: U1.P40(IO_L13P_17)
ZDOK1.DP_P28: U1.M38(IO_L2P_17)
ZDOK1.DP_P29: U1.AA36(IO_L4P_16)
ZDOK1.DP_P30: U1.W42(IO_L15P_16)
ZDOK1.DP_P31: U1.Y40(IO_L17P_16)
ZDOK1.DP_P32: U1.V38(IO_L7P_16)
ZDOK1.DP_P33: U1.V34(IO_L10P_MRCC_16)
ZDOK1.DP_P34: U1.T34(IO_L18P_17)
ZDOK1.DP_P35: U1.R40(IO_L17P_17)
ZDOK1.DP_P36: U1.N36(IO_L6P_17)
ZDOK1.DP_P37: U1.N38(IO_L5P_17)
NetR255_1: R255.1 U1.AH10(VFS_0)
NetR257_1: R257.1 R262.2 U51.1(A)
NetR317_1: R317.1 U1.AV24(IO_L12P_VRN_21)
NetR318_2: R318.2 U1.AV25(IO_L12N_VRP_21)

Not connected (* = marked no-connect by the designer): U1 AM26(IO_L9P_MRCC_22)* AN28(IO_L10P_MRCC_22)* AW32(IO_L4N_VREF_22)* BA30(IO_L8P_SRCC_22)* BB32(IO_L14N_VREF_22)*

### Buses and harness runs
bus DDR3.A[15..0]
bus DDR3.BA[2..0]
bus DDR3.DM[8..0]
bus DDR3.DQ[71..0]
bus DDR3.DQS_N[8..0]
bus DDR3.DQS_P[8..0]
bus QDR3.A[20..0]
bus QDR3.D[35..0]
bus QDR3.Q[35..0]
bus XL.PADDR[5..29]
bus XL.PBEn[0..3]
bus XL.PCSn[2..0]
bus ZDOK0.DP_N[37..0]
bus ZDOK0.DP_P[37..0]
bus ZDOK1.DP_N[37..0]
bus ZDOK1.DP_P[37..0]

### Layout directives
differential pair: V6_THERM_N, V6_THERM_P

### Notes on the sheet
- Device Compatibility:
  Bank 21 unavailable on LX240T/LX365T/SX315T
- Using LX240T/LX365T/SX315T
  will sacrifice half the data and 288
  MB part option
- Default MODE:
  '110' - Slave SelectMap
- (near R263) NOPOP
- Note:
  V6 Sensors will not be used for HW monitoring,
  hence the lack of more rigorous filtering
- 2009   THIS DOCUMENT IS THE PROPERTY OF THE OWNER, AND MAY NOT BE COPIED OR USED FOR ANY PURPOSE OTHER THAN THAT FOR WHICH IT IS SUPPLIED WITHOUT PERMISSION IN WRITING FROM THE OWNER.
- C
- DATESTAMP OF THIS PRINT
- DRAWN BY:
- DOCUMENT NUMBER:
- SCHEMATIC FILENAME:
- PCB FILENAME:
- ENGINEER:
- APPROVED:
- CIRCUIT DIAGRAM
- DATE
- SHEET
- REVISION
- OF

### Library data of the parts
C361-C363 = CAP-TAN-1: 47uF, Conductive Polymer Chip Capacitor; Manufacturer: KEMET; PartNum: T520T476M006ATE070; Tolerance: 20%; ESR: 0.07; POD number: CAP-TAN-1; Value: 47uF; RoHS: Y; Sort Value: 47; Category: Capacitors; Subcategory: Tantalum
C365-C367 C369 = CAP-CER-11: 4.7uF, Ceramic Capacitor; Manufacturer: MURATA; PartNum: AMK105BJ475MV-F; Tolerance: 20%; Dielectric: X5R; POD number: CAP-CER-11; Value: 4.7uF; RoHS: Y; Sort Value: 4.7; Category: Capacitors; Subcategory: Ceramic
C368 = CAP-CER-7: as C553 on sheet qdr0_1; POD number: CAP-CER-7; Value: 0.47uF; RoHS: Y; Sort Value: 0.47; Category: Capacitors; Subcategory: Ceramic
C371 = CAP-CER-1: as C513-C520 on sheet qdr0_1; POD number: CAP-CER-1; Value: 0.1uF; RoHS: Y; Sort Value: 0.1; Category: Capacitors; Subcategory: Ceramic
R253 R254 R256-R261 R263 = RES-TF-7: 3K3, 1.1mm x 0.5mm, Thick Film Resistor; Manufacturer: ROYALOHM; PartNum: 0402WGJ0332T1E; Tolerance: 5%; Rating: 0.0625W; POD number: RES-TF-7; Value: 3K3; Sort Value: 3300; Category: Resistors; Subcategory: ThickFilm; HelpURL: *.pdf
R255 R262 R300 R334 R335 = RES-TF-0: as R301-R308 on sheet qdr0_1; POD number: RES-TF-0; Value: 0R; Sort Value: 0; Category: Resistors; Subcategory: ThickFilm; HelpURL: *.pdf
R317 R318 = RES-TF-10: as R114 on sheet qdr0_1; POD number: RES-TF-10; Value: 49R9; Sort Value: 49.9; Category: Resistors; Subcategory: ThickFilm; HelpURL: *.pdf
TP1 = ELMECH-TP-0: as TP12-TP15 on sheet qdr0_1; POD number: ELMECH-TP-0; RoHS: Y; Category: ELMECH; Subcategory: Test Points
U1 = IC-PLD-0: Virtex-6 475SXT 1760-pin FPGA; Manufacturer: Xilinx; POD number: IC-PLD-0; PartNum: XC6VSX475T-1FFG1759C; RoHS: Y; Category: IC; Subcategory: PLD
U51 = IC-LOG-0: TinyLogic® HS 2-Input AND Gate; Manufacturer: Fairchild Semiconductor; POD number: IC-LOG-0; PartNum: NC7S08M5X; RoHS: Y; Category: IC; Subcategory: Logic